# EAGLE design hauptplatine (EAGLE 9.6.2)
AUTHOR: Tobias Poppe; DOC_NR: 1; REV: 1.1

## Sheet 1 of 3
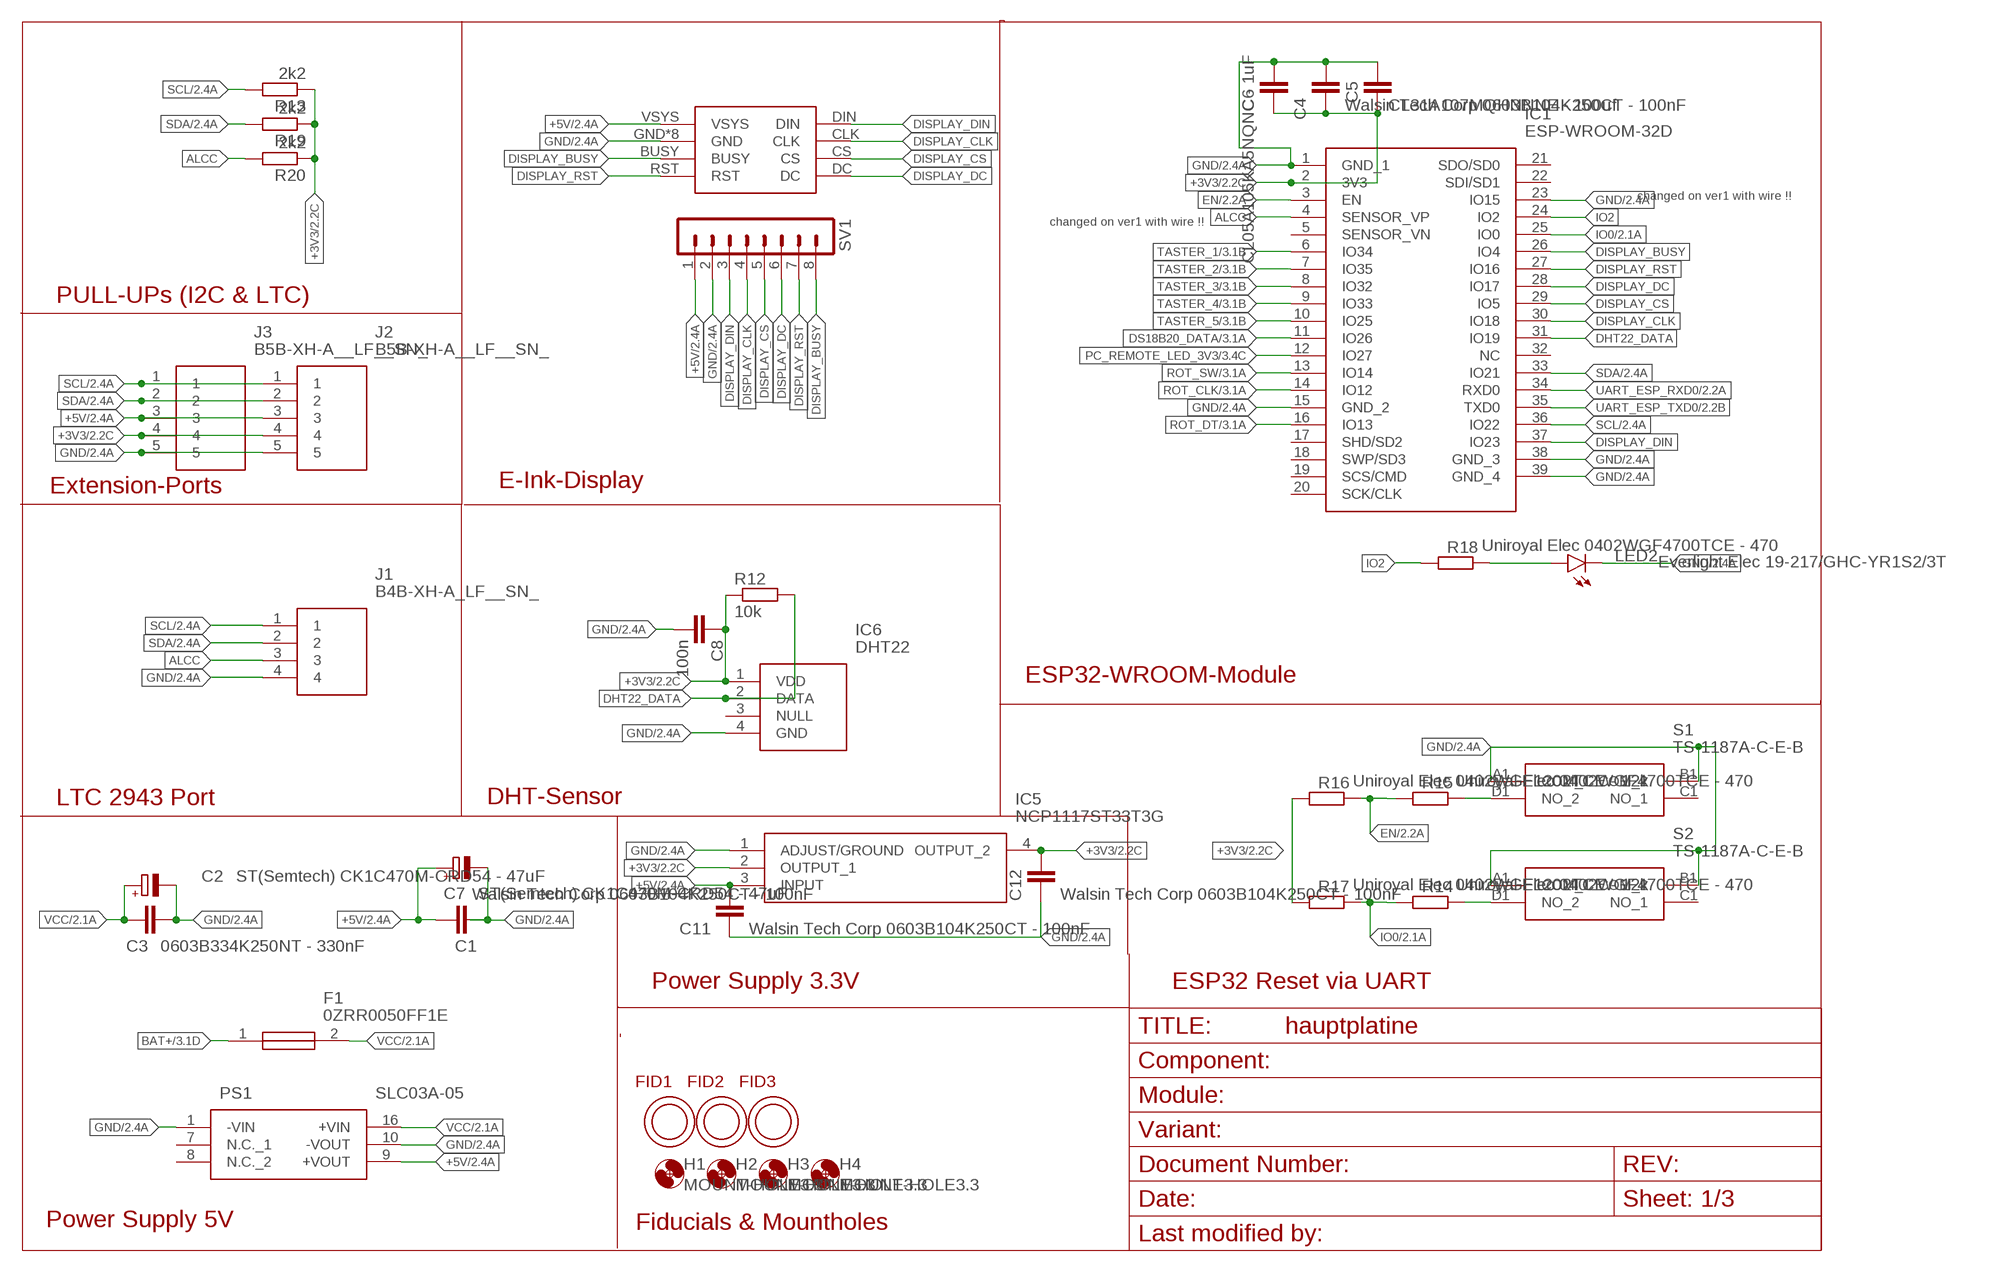
[diagram p0: schematic, sheet 1]

### Parts
C1  Walsin Tech Corp 0603B104K250CT - 100nF  C-EUC0603  [C0603]
C2  ST(Semtech) CK1C470M-CRD54 - 47uF  CPOL-EUC  [PANASONIC_C]
C3  0603B334K250NT - 330nF  C-EUC0603  [C0603]
C4  Walsin Tech Corp 0603B104K250CT - 100nF  C-EUC0603  [C0603]
C5  CL31A107MQHNNNE - 100uf  C-EUC1206  [C1206]
C6  CL05A105KA5NQNC - 1uF  C-EUC0402  [C0402]
C7  ST(Semtech) CK1C470M-CRD54 - 47uF  CPOL-EUC  [PANASONIC_C]
C8  100n  C-EUC1206  [C1206]
C11  Walsin Tech Corp 0603B104K250CT - 100nF  C-EUC0603  [C0603]
C12  Walsin Tech Corp 0603B104K250CT - 100nF  C-EUC0603  [C0603]
F1  0ZRR0050FF1E  [0ZRR0050FF1E]
FID1  OPEN-PNP-FIDUCIAL  [OPEN-PNP-FIDUCIAL]
FID2  OPEN-PNP-FIDUCIAL  [OPEN-PNP-FIDUCIAL]
FID3  OPEN-PNP-FIDUCIAL  [OPEN-PNP-FIDUCIAL]
H1  MOUNT-HOLE3.3  [3,3]
H2  MOUNT-HOLE3.3  [3,3]
H3  MOUNT-HOLE3.3  [3,3]
H4  MOUNT-HOLE3.3  [3,3]
IC1  ESP-WROOM-32D  [ESPWROOM32D]
IC5  NCP1117ST33T3G  [SOT230P700X180-4N]
IC6  DHT22  [DHT22]
J1  B4B-XH-A_LF__SN_  [B4BXHALFSN]
J2  B5B-XH-A__LF__SN_  [SHDR5W64P0X250_1X5_1490X575X70]
J3  B5B-XH-A__LF__SN_  [SHDR5W64P0X250_1X5_1490X575X70]
LED2  Everlight Elec 19-217/GHC-YR1S2/3T  LEDCHIPLED_0603  [CHIPLED_0603]
PS1  SLC03A-05  [SLC03A05]
R12  10k  R-EU_R1206  [R1206]
R13  2k2  R-EU_R1206  [R1206]
R14  Uniroyal Elec 0402WGF4700TCE - 470  R-EU_R0402  [R0402]
R15  Uniroyal Elec 0402WGF4700TCE - 470  R-EU_R0402  [R0402]
R16  Uniroyal Elec 0402WGF1202TCE - 12k  R-EU_R0402  [R0402]
R17  Uniroyal Elec 0402WGF1202TCE - 12k  R-EU_R0402  [R0402]
R18  Uniroyal Elec 0402WGF4700TCE - 470  R-EU_R0402  [R0402]
R19  2k2  R-EU_R1206  [R1206]
R20  2k2  R-EU_R1206  [R1206]
S1  TS-1187A-C-E-B  [TS1187ACEB]
S2  TS-1187A-C-E-B  [TS1187ACEB]
SV1  MA08-1  [MA08-1]
U$1  PICO-EPAPER-2.9-V3  [PICO-EPAPER-2.9-V3]

### Nets
+3V3: C4.1 C5.2 C6.1 C8.1 C12.2 IC1.2(3V3) IC5.2(OUTPUT_1) IC5.4(OUTPUT_2) IC6.1(VDD) J2.4 J3.4 R12.1 R13.1 R16.1 R17.1 R19.1 R20.1 ; also sheet 2,3
+5V: C1.1 C7.+ C11.2 IC5.3(INPUT) J2.3 J3.3 PS1.9(+VOUT) SV1.1 U$1.VSYS ; also sheet 2,3
ALCC: IC1.4(SENSOR_VP) J1.3 R20.2
BAT+: F1.1 ; also sheet 3
DHT22_DATA: IC1.31(IO19) IC6.2(DATA) R12.2
DISPLAY_BUSY: IC1.26(IO4) SV1.8 U$1.BUSY
DISPLAY_CLK: IC1.30(IO18) SV1.4 U$1.CLK
DISPLAY_CS: IC1.29(IO5) SV1.5 U$1.CS
DISPLAY_DC: IC1.28(IO17) SV1.6 U$1.DC
DISPLAY_DIN: IC1.37(IO23) SV1.3 U$1.DIN
DISPLAY_RST: IC1.27(IO16) SV1.7 U$1.RST
DS18B20_DATA: IC1.11(IO26) ; also sheet 3
EN: IC1.3(EN) R15.1 R16.2 ; also sheet 2
GND: C1.2 C2.- C3.1 C4.2 C5.1 C6.2 C7.- C8.2 C11.1 C12.1 IC1.1(GND_1) IC1.15(GND_2) IC1.23(IO15) IC1.38(GND_3) IC1.39(GND_4) IC5.1(ADJUST/GROUND) IC6.4(GND) J1.4 J2.5 J3.5 LED2.C PS1.1(-VIN) PS1.10(-VOUT) S1.A1(COM_1) S1.B1(COM_2) S2.A1(COM_1) S2.B1(COM_2) SV1.2 U$1.GND U$1.GND1(GND) U$1.GND2(GND) U$1.GND3(GND) U$1.GND4(GND) U$1.GND5(GND) U$1.GND6(GND) U$1.GND7(GND) ; also sheet 2,3
IO0: IC1.25(IO0) R14.1 R17.2 ; also sheet 2
IO2: IC1.24(IO2) R18.1
N$10: R15.2 S1.D1(NO_2)
N$11: R14.2 S2.D1(NO_2)
N$12: LED2.A R18.2
PC_REMOTE_LED_3V3: IC1.12(IO27) ; also sheet 3
ROT_CLK: IC1.14(IO12) ; also sheet 3
ROT_DT: IC1.16(IO13) ; also sheet 3
ROT_SW: IC1.13(IO14) ; also sheet 3
SCL: IC1.36(IO22) J1.1 J2.1 J3.1 R13.2 ; also sheet 2
SDA: IC1.33(IO21) J1.2 J2.2 J3.2 R19.2 ; also sheet 2
TASTER_1: IC1.6(IO34) ; also sheet 3
TASTER_2: IC1.7(IO35) ; also sheet 3
TASTER_3: IC1.8(IO32) ; also sheet 3
TASTER_4: IC1.9(IO33) ; also sheet 3
TASTER_5: IC1.10(IO25) ; also sheet 3
UART_ESP_RXD0: IC1.34(RXD0) ; also sheet 2
UART_ESP_TXD0: IC1.35(TXD0) ; also sheet 2
VCC: C2.+ C3.2 F1.2 PS1.16(+VIN) ; also sheet 2,3
Unconnected: IC1.5(SENSOR_VN) IC1.17(SHD/SD2) IC1.18(SWP/SD3) IC1.19(SCS/CMD) IC1.20(SCK/CLK) IC1.21(SDO/SD0) IC1.22(SDI/SD1) IC1.32(NC) IC6.3(NULL) PS1.7(N.C._1) PS1.8(N.C._2) S1.C1(NO_1) S2.C1(NO_1)

### Notes on the sheet
- changed on ver1 with wire !!
- changed on ver1 with wire !!
- PULL-UPs (I2C & LTC)
- Extension-Ports | E-Ink-Display
- ESP32-WROOM-Module
- LTC 2943 Port | DHT-Sensor
- Power Supply 3.3V | ESP32 Reset via UART
- Power Supply 5V | Fiducials & Mountholes

## Sheet 2 of 3
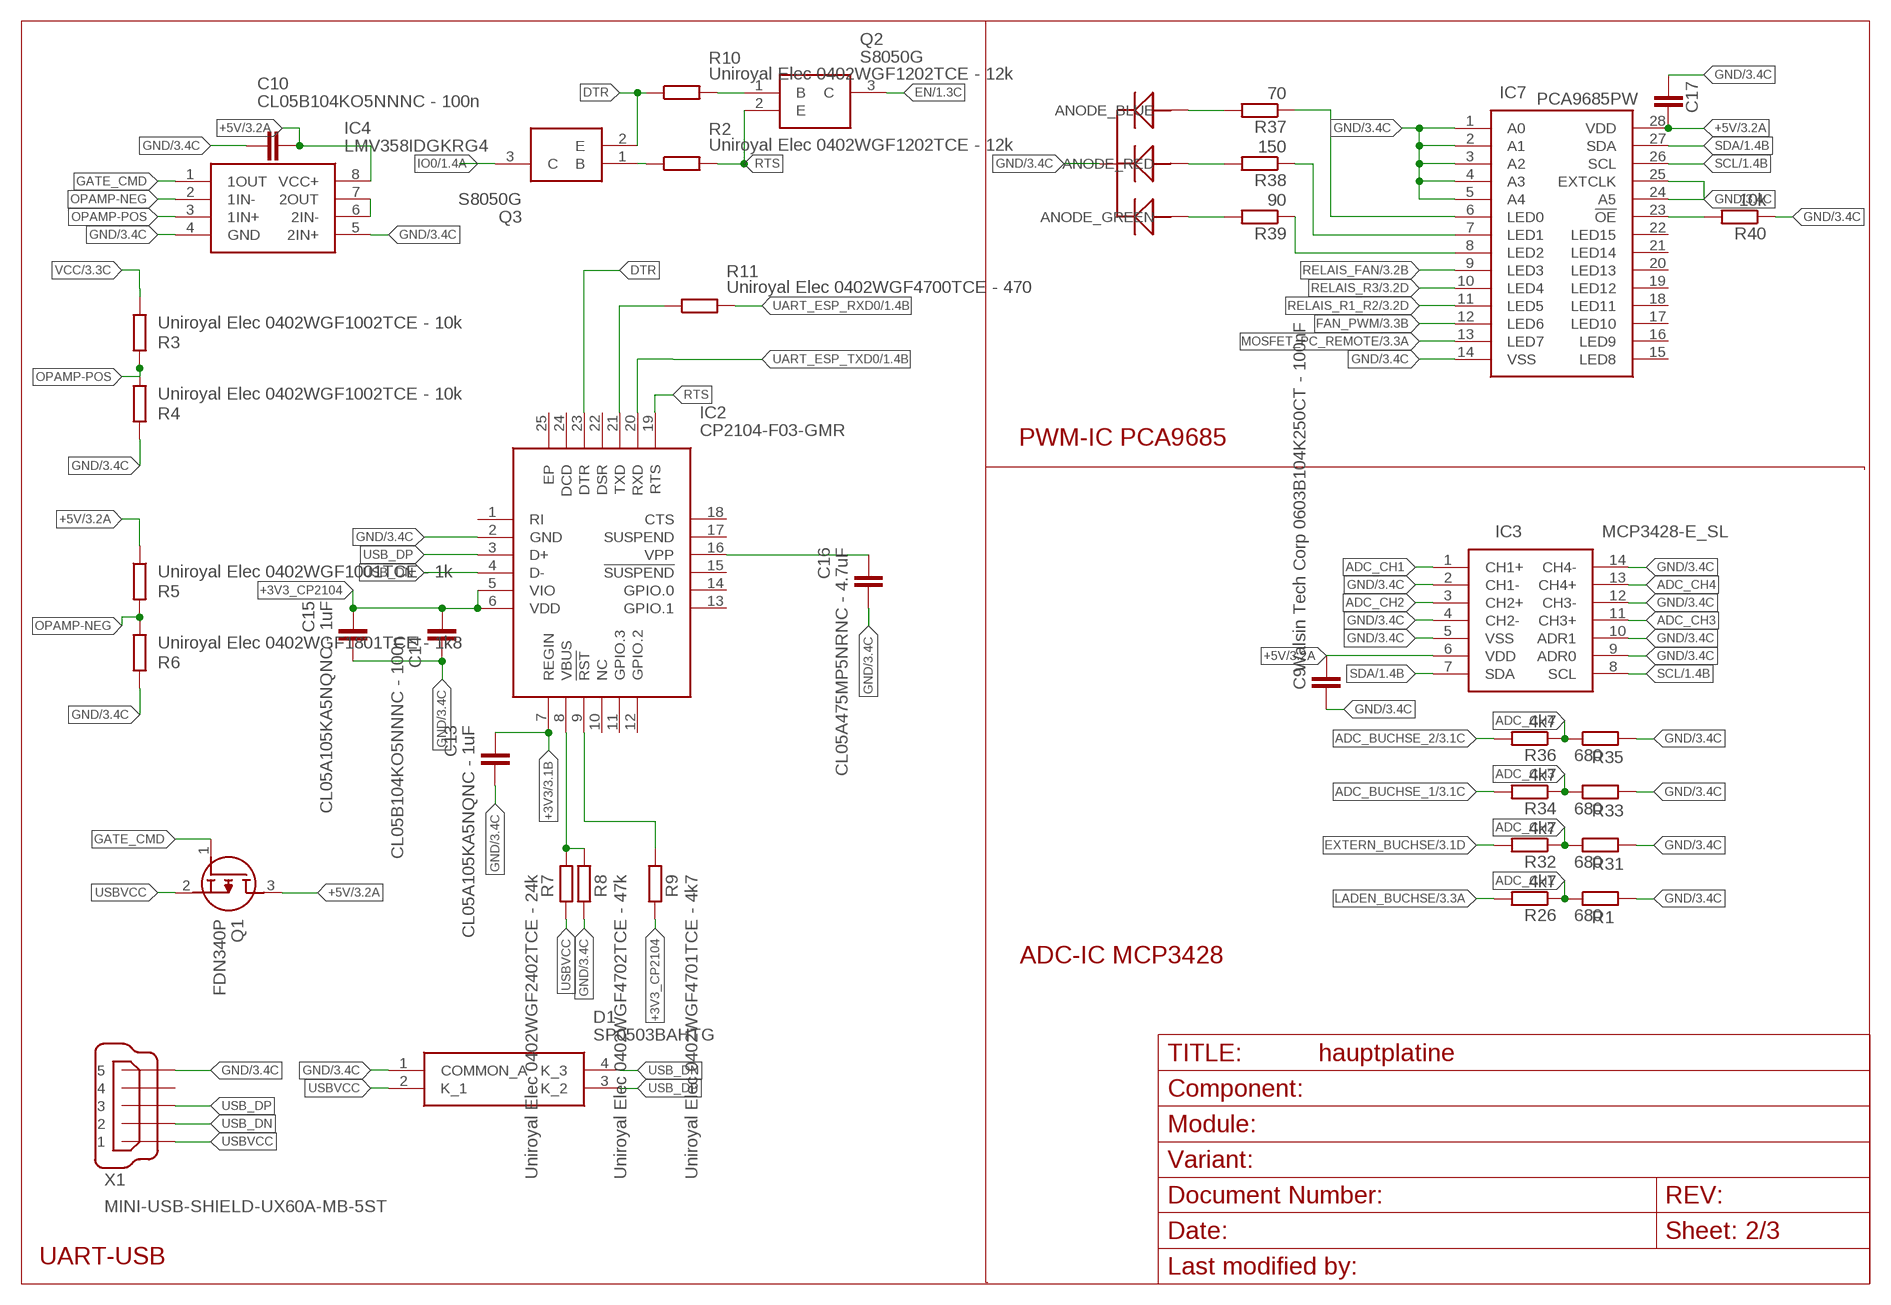
[diagram p1: schematic, sheet 2]

### Parts
C9  Walsin Tech Corp 0603B104K250CT - 100nF  C-EUC0603  [C0603]
C10  CL05B104KO5NNNC - 100n  C-EUC0402  [C0402]
C13  CL05A105KA5NQNC - 1uF  C-EUC0402  [C0402]
C14  CL05B104KO5NNNC - 100n  C-EUC0402  [C0402]
C15  CL05A105KA5NQNC - 1uF  C-EUC0402  [C0402]
C16  CL05A475MP5NRNC - 4.7uF  C-EUC0402  [C0402]
C17  Walsin Tech Corp 0603B104K250CT - 100nF  C-EUC0603  [C0603]
D1  SP0503BAHTG  [SP0503BAHTG]
IC2  CP2104-F03-GMR  [QFN50P400X400X80-25N]
IC3  MCP3428-E_SL  [SOIC127P600X175-14N]
IC4  LMV358IDGKRG4  [SOP65P490X110-8N]
IC7  PCA9685PW  [SOP65P640X110-28N]
Q1  FDN340P  [SOT95P237X112-3N]
Q2  S8050G  [SOT95P240X110-3N]
Q3  S8050G  [SOT95P240X110-3N]
R1  680  R-EU_R1206  [R1206]
R2  Uniroyal Elec 0402WGF1202TCE - 12k  R-EU_R0402  [R0402]
R3  Uniroyal Elec 0402WGF1002TCE - 10k  R-EU_R0402  [R0402]
R4  Uniroyal Elec 0402WGF1002TCE - 10k  R-EU_R0402  [R0402]
R5  Uniroyal Elec 0402WGF1001TCE - 1k  R-EU_R0402  [R0402]
R6  Uniroyal Elec 0402WGF1801TCE - 1k8  R-EU_R0402  [R0402]
R7  Uniroyal Elec 0402WGF2402TCE - 24k  R-EU_R0402  [R0402]
R8  Uniroyal Elec 0402WGF4702TCE - 47k  R-EU_R0402  [R0402]
R9  Uniroyal Elec 0402WGF4701TCE - 4k7  R-EU_R0402  [R0402]
R10  Uniroyal Elec 0402WGF1202TCE - 12k  R-EU_R0402  [R0402]
R11  Uniroyal Elec 0402WGF4700TCE - 470  R-EU_R0402  [R0402]
R26  4k7  R-EU_R1206  [R1206]
R31  680  R-EU_R1206  [R1206]
R32  4k7  R-EU_R1206  [R1206]
R33  680  R-EU_R1206  [R1206]
R34  4k7  R-EU_R1206  [R1206]
R35  680  R-EU_R1206  [R1206]
R36  4k7  R-EU_R1206  [R1206]
R37  70  R-EU_R1206  [R1206]
R38  150  R-EU_R1206  [R1206]
R39  90  R-EU_R1206  [R1206]
R40  10k  R-EU_R1206  [R1206]
U$12  RG_LED_5MM  [RGB_LED_5MM]
X1  MINI-USB-SHIELD-UX60A-MB-5ST  [UX60A-MB-5ST]

### Nets
+3V3: C13.2 IC2.7(REGIN) ; also sheet 1,3
+3V3_CP2104: C14.2 C15.2 IC2.5(VIO) IC2.6(VDD) R9.2
+5V: C9.2 C10.2 C17.1 IC3.6(VDD) IC4.8(VCC+) IC7.28(VDD) Q1.3(D) R5.1 ; also sheet 1,3
ADC_BUCHSE_1: R34.2 ; also sheet 3
ADC_BUCHSE_2: R36.2 ; also sheet 3
ADC_CH1: IC3.1(CH1+) R1.1 R26.1
ADC_CH2: IC3.3(CH2+) R31.1 R32.1
ADC_CH3: IC3.11(CH3+) R33.1 R34.1
ADC_CH4: IC3.13(CH4+) R35.1 R36.1
DTR: IC2.23(DTR) Q3.2(E) R10.1
EN: Q2.3(C) ; also sheet 1
EXTERN_BUCHSE: R32.2 ; also sheet 3
FAN_PWM: IC7.12(LED6) ; also sheet 3
GATE_CMD: IC4.1(1OUT) Q1.1(G)
GND: C9.1 C10.1 C13.1 C14.1 C15.1 C16.1 C17.2 D1.1(COMMON_A) IC2.2(GND) IC3.2(CH1-) IC3.4(CH2-) IC3.5(VSS) IC3.9(ADR0) IC3.10(ADR1) IC3.12(CH3-) IC3.14(CH4-) IC4.4(GND) IC4.5(2IN+) IC7.1(A0) IC7.2(A1) IC7.3(A2) IC7.4(A3) IC7.5(A4) IC7.14(VSS) IC7.24(A5) IC7.25(EXTCLK) R1.2 R4.2 R6.2 R8.2 R31.2 R33.2 R35.2 R40.1 U$12.CATHODE X1.5 ; also sheet 1,3
IO0: Q3.3(C) ; also sheet 1
LADEN_BUCHSE: R26.2 ; also sheet 3
MOSFET_PC_REMOTE: IC7.13(LED7) ; also sheet 3
N$3: Q3.1(B) R2.1
N$4: IC4.6(2IN-) IC4.7(2OUT)
N$5: IC2.8(VBUS) R7.1 R8.1
N$6: IC2.9(!RST) R9.1
N$7: C16.2 IC2.16(VPP)
N$8: IC2.21(TXD) R11.1
N$9: Q2.1(B) R10.2
N$16: R39.2 U$12.ANODE_GREEN
N$20: R37.2 U$12.ANODE_BLUE
N$22: R38.2 U$12.ANODE_RED
N$23: IC7.23(!OE) R40.2
OPAMP-NEG: IC4.2(1IN-) R5.2 R6.1
OPAMP-POS: IC4.3(1IN+) R3.2 R4.1
RELAIS_FAN: IC7.9(LED3) ; also sheet 3
RELAIS_R1_R2: IC7.11(LED5) ; also sheet 3
RELAIS_R3: IC7.10(LED4) ; also sheet 3
RGB_BLAU1: IC7.6(LED0) R37.1
RGB_GREEN1: IC7.8(LED2) R39.1
RGB_ROT1: IC7.7(LED1) R38.1
RTS: IC2.19(RTS) Q2.2(E) R2.2
SCL: IC3.8(SCL) IC7.26(SCL) ; also sheet 1
SDA: IC3.7(SDA) IC7.27(SDA) ; also sheet 1
UART_ESP_RXD0: R11.2 ; also sheet 1
UART_ESP_TXD0: IC2.20(RXD) ; also sheet 1
USB_DN: D1.4(K_3) IC2.4(D-) X1.2
USB_DP: D1.3(K_2) IC2.3(D+) X1.3
USBVCC: D1.2(K_1) Q1.2(S) R7.2 X1.1
VCC: R3.1 ; also sheet 1,3
Unconnected: IC2.1(RI) IC2.10(NC) IC2.11(GPIO.3) IC2.12(GPIO.2) IC2.13(GPIO.1) IC2.14(GPIO.0) IC2.15(!SUSPEND) IC2.17(SUSPEND) IC2.18(CTS) IC2.22(DSR) IC2.24(DCD) IC2.25(EP) IC7.15(LED8) IC7.16(LED9) IC7.17(LED10) IC7.18(LED11) IC7.19(LED12) IC7.20(LED13) IC7.21(LED14) IC7.22(LED15) X1.4 X1.M1(S1) X1.M2(S2) X1.M3(S3) X1.M4(S4)

### Notes on the sheet
- PWM-IC PCA9685
- ADC-IC MCP3428
- UART-USB

## Sheet 3 of 3
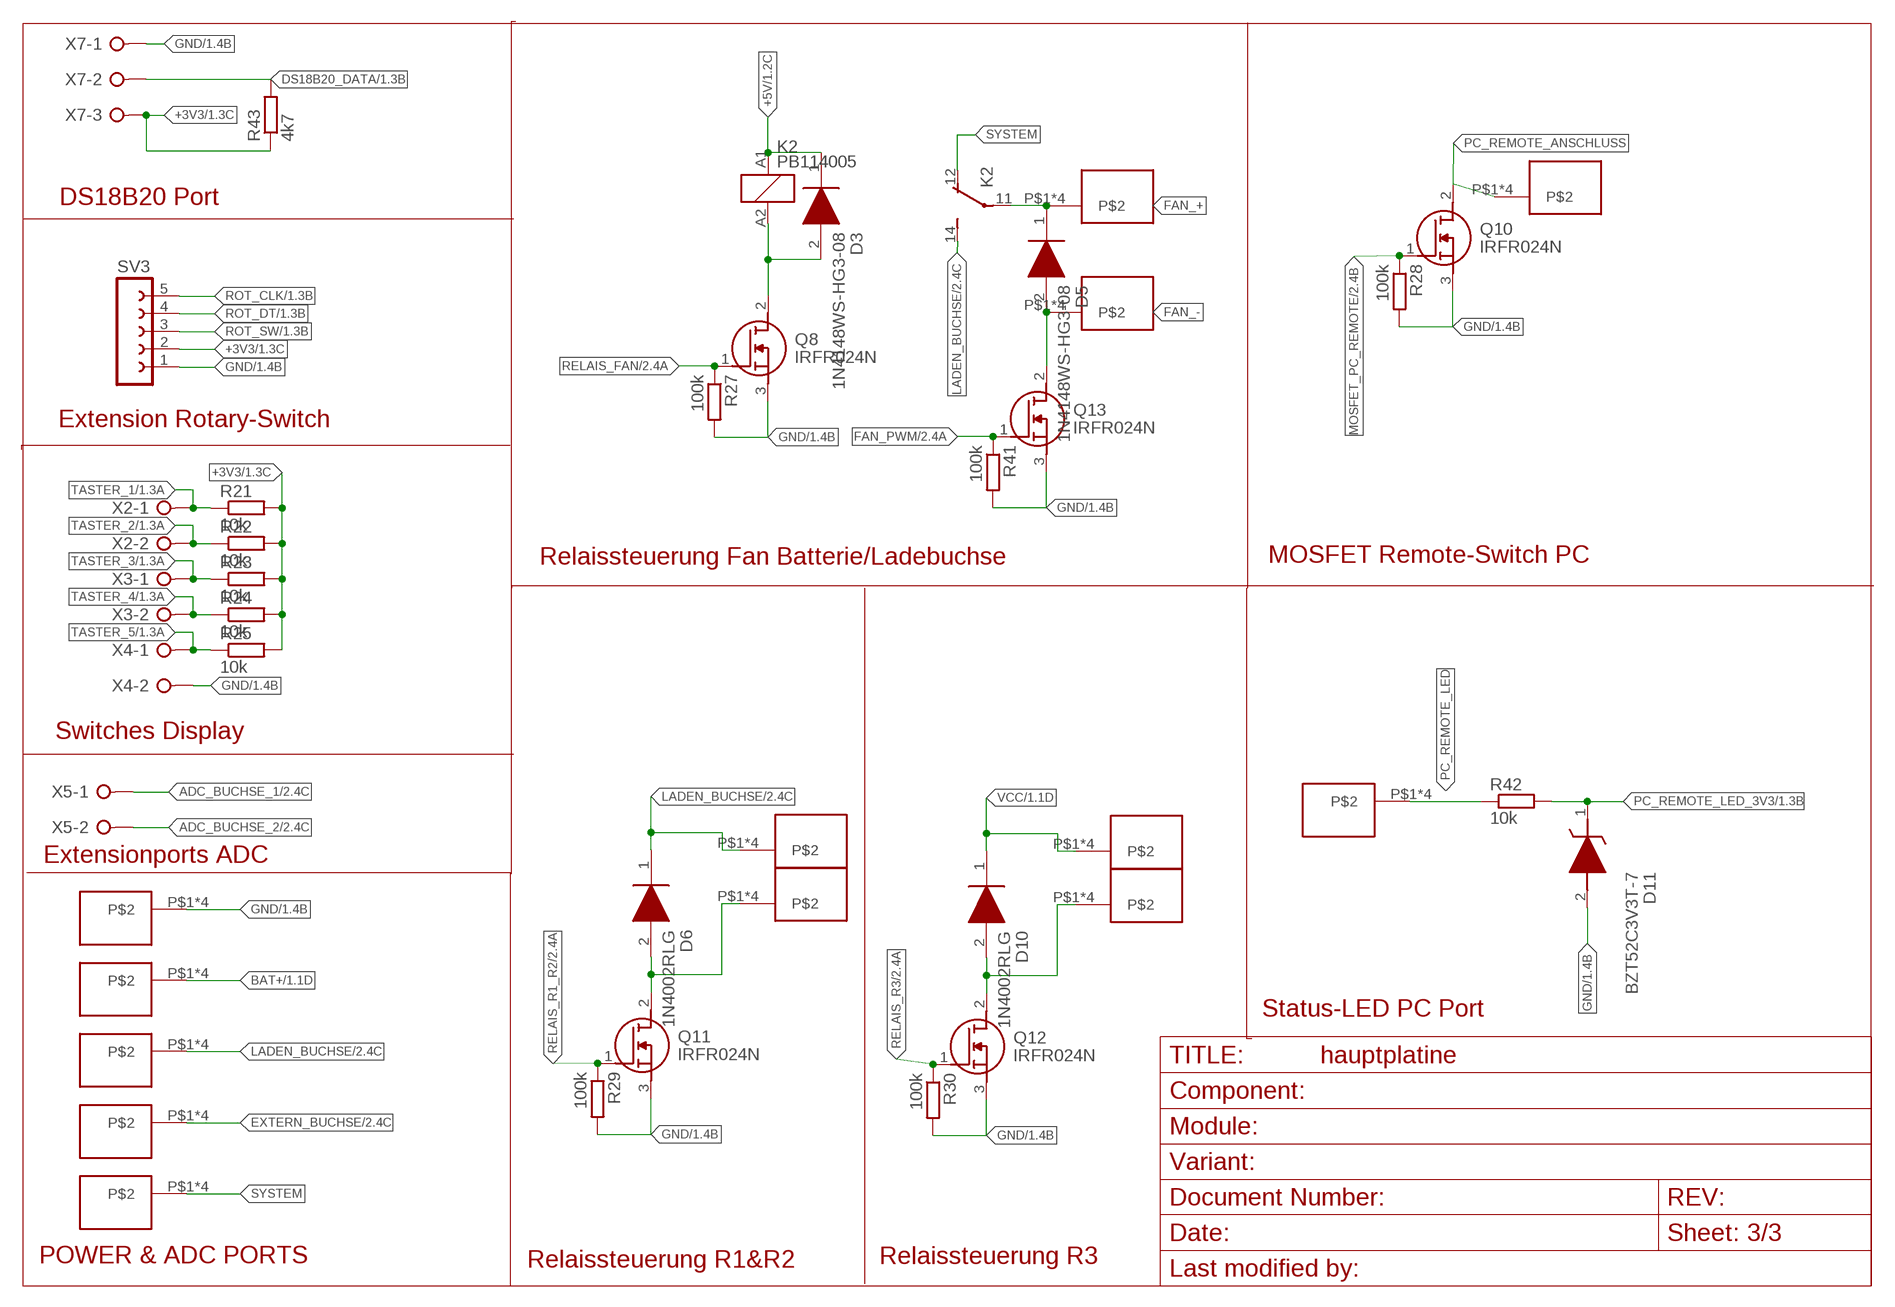
[diagram p2: schematic, sheet 3]

### Parts
D3  1N4148WS-HG3-08  [SOD2713X115N]
D5  1N4148WS-HG3-08  [SOD2713X115N]
D6  1N4002RLG  [DIOAD1405W86L465D235]
D10  1N4002RLG  [DIOAD1405W86L465D235]
D11  BZT52C3V3T-7  [SODFL1608X65N]
K2  PB114005  PB114006  [PB]
Q8  IRFR024N  IRFR024TRPBF-BE3  [IRFR024TRPBFBE3]
Q10  IRFR024N  IRFR024TRPBF-BE3  [IRFR024TRPBFBE3]
Q11  IRFR024N  IRFR024TRPBF-BE3  [IRFR024TRPBFBE3]
Q12  IRFR024N  IRFR024TRPBF-BE3  [IRFR024TRPBFBE3]
Q13  IRFR024N  IRFR024TRPBF-BE3  [IRFR024TRPBFBE3]
R21  10k  R-EU_R0805  [R0805]
R22  10k  R-EU_R0805  [R0805]
R23  10k  R-EU_R0805  [R0805]
R24  10k  R-EU_R0805  [R0805]
R25  10k  R-EU_R0805  [R0805]
R27  100k  R-EU_R1206  [R1206]
R28  100k  R-EU_R1206  [R1206]
R29  100k  R-EU_R1206  [R1206]
R30  100k  R-EU_R1206  [R1206]
R41  100k  R-EU_R1206  [R1206]
R42  10k  R-EU_R1206  [R1206]
R43  4k7  R-EU_R0805  [R0805]
SV3  FE05-1  [FE05-1]
U$2  WE-REDCUBE-74650173  [WE-REDCUBE-74650173]
U$17  WE-REDCUBE-74650173  [WE-REDCUBE-74650173]
U$18  WE-REDCUBE-74650173  [WE-REDCUBE-74650173]
U$19  WE-REDCUBE-74650173  [WE-REDCUBE-74650173]
U$20  WE-REDCUBE-74650173  [WE-REDCUBE-74650173]
U$21  WE-REDCUBE-74650173  [WE-REDCUBE-74650173]
U$22  WE-REDCUBE-74650173  [WE-REDCUBE-74650173]
U$23  WE-REDCUBE-74650173  [WE-REDCUBE-74650173]
U$24  WE-REDCUBE-74650173  [WE-REDCUBE-74650173]
U$25  WE-REDCUBE-74650173  [WE-REDCUBE-74650173]
U$26  WE-REDCUBE-74650173  [WE-REDCUBE-74650173]
U$27  WE-REDCUBE-74650173  [WE-REDCUBE-74650173]
U$28  WE-REDCUBE-74650173  [WE-REDCUBE-74650173]
X2  W237-02P  [W237-132]
X3  W237-02P  [W237-132]
X4  W237-02P  [W237-132]
X5  W237-02P  [W237-132]
X7  W237-3E  [W237-3E]

### Nets
+3V3: R21.2 R22.2 R23.2 R24.2 R25.2 R43.1 SV3.2 X7.3 ; also sheet 1,2
+5V: D3.1(K) K2.A1 ; also sheet 1,2
ADC_BUCHSE_1: X5.1 ; also sheet 2
ADC_BUCHSE_2: X5.2 ; also sheet 2
BAT+: U$17.P$1 U$17.P$2 U$17.P$3 U$17.P$4 ; also sheet 1
DS18B20_DATA: R43.2 X7.2 ; also sheet 1
EXTERN_BUCHSE: U$19.P$1 U$19.P$2 U$19.P$3 U$19.P$4 ; also sheet 2
FAN_+: D5.1(K) K2.11(2:P) U$24.P$1 U$24.P$2 U$24.P$3 U$24.P$4
FAN_-: D5.2(A) Q13.2(D) U$27.P$1 U$27.P$2 U$27.P$3 U$27.P$4
FAN_PWM: Q13.1(G) R41.1 ; also sheet 2
GND: D11.2(A) Q8.3(S) Q10.3(S) Q11.3(S) Q12.3(S) Q13.3(S) R27.2 R28.2 R29.2 R30.2 R41.2 SV3.1 U$2.P$1 U$2.P$2 U$2.P$3 U$2.P$4 X4.2 X7.1 ; also sheet 1,2
LADEN_BUCHSE: D6.1(K) K2.14(2:S) U$18.P$1 U$18.P$2 U$18.P$3 U$18.P$4 U$21.P$1 U$21.P$2 U$21.P$3 U$21.P$4 ; also sheet 2
MOSFET_PC_REMOTE: Q10.1(G) R28.1 ; also sheet 2
N$13: D3.2(A) K2.A2 Q8.2(D)
PC_REMOTE_ANSCHLUSS: Q10.2(D) U$25.P$1 U$25.P$2 U$25.P$3 U$25.P$4
PC_REMOTE_LED: R42.1 U$28.P$1 U$28.P$2 U$28.P$3 U$28.P$4
PC_REMOTE_LED_3V3: D11.1(K) R42.2 ; also sheet 1
RELAIS_FAN: Q8.1(G) R27.1 ; also sheet 2
RELAIS_R1_R2: Q11.1(G) R29.1 ; also sheet 2
RELAIS_R1_R2_ANSCHLUSS: D6.2(A) Q11.2(D) U$20.P$1 U$20.P$2 U$20.P$3 U$20.P$4
RELAIS_R3: Q12.1(G) R30.1 ; also sheet 2
RELAIS_R3_ANSCHLUSS: D10.2(A) Q12.2(D) U$22.P$1 U$22.P$2 U$22.P$3 U$22.P$4
ROT_CLK: SV3.5 ; also sheet 1
ROT_DT: SV3.4 ; also sheet 1
ROT_SW: SV3.3 ; also sheet 1
SYSTEM: K2.12(2:O) U$26.P$1 U$26.P$2 U$26.P$3 U$26.P$4
TASTER_1: R21.1 X2.1 ; also sheet 1
TASTER_2: R22.1 X2.2 ; also sheet 1
TASTER_3: R23.1 X3.1 ; also sheet 1
TASTER_4: R24.1 X3.2 ; also sheet 1
TASTER_5: R25.1 X4.1 ; also sheet 1
VCC: D10.1(K) U$23.P$1 U$23.P$2 U$23.P$3 U$23.P$4 ; also sheet 1,2

### Notes on the sheet
- DS18B20 Port
- Extension Rotary-Switch
- Relaissteuerung Fan Batterie/Ladebuchse | MOSFET Remote-Switch PC
- Switches Display
- Extensionports ADC
- Status-LED PC Port
- POWER & ADC PORTS | Relaissteuerung R1&R2 | Relaissteuerung R3

## Library data of the parts
C1 C3-C6 C9-C17 = rcl:C-EU: CAPACITOR, European symbol; SPICEPREFIX: C
C2 C7 = rcl:CPOL-EU: POLARIZED CAPACITOR, European symbol; SPICEPREFIX: C
C8 = rcl:C-EU: CAPACITOR, European symbol
D1 = samacsys:SP0503BAHTG: ESD Suppressors / TVS Diodes TVS AVAL DIODE SMT Source: Datasheet <https://nl.mouser.com/datasheet/2/240/Littelfuse_TVS_Diode_Array_SP05_Datasheet.pdf-777043.pdf>; ARROW_PART_NUMBER: SP0503BAHTG; ARROW_PRICE-STOCK: https://www.arrow.com/en/products/sp0503bahtg/littelfuse; DESCRIPTION: ESD Suppressors / TVS Diodes TVS AVAL DIODE SMT; HEIGHT: 1.22mm; MANUFACTURER_NAME: LITTELFUSE; MANUFACTURER_PART_NUMBER: SP0503BAHTG; MOUSER_PART_NUMBER: 576-SP0503BAHTG; MOUSER_PRICE-STOCK: https://www.mouser.co.uk/ProductDetail/Littelfuse/SP0503BAHTG?qs=uD%2FdkN7XIa0NTYXwHdELYA%3D%3D
D3 D5 = samacsys:1N4148WS-HG3-08: Diodes - General Purpose, Power, Switching 1V Vf, 4pF; 25nA Ir SOD-323 Source: Datasheet <https://mouser.componentsearchengine.com/Datasheets/1/1N4148WS-HG3-08.pdf>; ARROW_PART_NUMBER: 1N4148WS-HG3-08; ARROW_PRICE-STOCK: https://www.arrow.com/en/products/1n4148ws-hg3-08/vishay; DESCRIPTION: Diodes - General Purpose, Power, Switching 1V Vf, 4pF; 25nA Ir SOD-323; HEIGHT: 1.15mm; MANUFACTURER_NAME: Vishay; MANUFACTURER_PART_NUMBER: 1N4148WS-HG3-08; MOUSER_PART_NUMBER: 78-1N4148WS-HG3-08; MOUSER_PRICE-STOCK: https://www.mouser.co.uk/ProductDetail/Vishay-Semiconductors/1N4148WS-HG3-08?qs=MLItCLRbWsz%2FnO5zs5RZvA%3D%3D
D6 D10 = samacsys:1N4002RLG: Source: Datasheet <http://www.onsemi.com/pub/Collateral/1N4001-D.PDF>; ARROW_PART_NUMBER: 1N4002RLG; ARROW_PRICE-STOCK: https://www.arrow.com/en/products/1n4002rlg/on-semiconductor; HEIGHT: mm; MANUFACTURER_NAME: ON Semiconductor; MANUFACTURER_PART_NUMBER: 1N4002RLG; MOUSER_PART_NUMBER: 863-1N4002RLG; MOUSER_PRICE-STOCK: https://www.mouser.co.uk/ProductDetail/ON-Semiconductor/1N4002RLG/?qs=y2kkmE52mdMfmlxIpNIwcg%3D%3D
D11 = samacsys:BZT52C3V3T-7: Diodes Inc BZT52C3V3T-7 Zener Diode, 3.3V 6% 300 mW SMT 2-Pin SOD-523 Source: Datasheet <http://docs-emea.rs-online.com/webdocs/1325/0900766b81325340.pdf>; ARROW_PART_NUMBER: BZT52C3V3T-7; ARROW_PRICE-STOCK: https://www.arrow.com/en/products/bzt52c3v3t-7/diodes-incorporated; DESCRIPTION: Diodes Inc BZT52C3V3T-7 Zener Diode, 3.3V 6% 300 mW SMT 2-Pin SOD-523; HEIGHT: 0.65mm; MANUFACTURER_NAME: Diodes Inc.; MANUFACTURER_PART_NUMBER: BZT52C3V3T-7; MOUSER_PART_NUMBER: 621-BZT52C3V3T-7; MOUSER_PRICE-STOCK: https://www.mouser.co.uk/ProductDetail/Diodes-Incorporated/BZT52C3V3T-7?qs=zLeapIUCO8SeTE43ANZQdw%3D%3D
F1 = samacsys:0ZRR0050FF1E: Resettable Fuses - PPTC Resettable Fuse 500mA Source: Datasheet <https://www.mouser.in/datasheet/2/643/bel_06192018_0ZRR_Feb2018-1500412.pdf>; DESCRIPTION: Resettable Fuses - PPTC Resettable Fuse 500mA; HEIGHT: 13.7mm; MANUFACTURER_NAME: Bel; MANUFACTURER_PART_NUMBER: 0ZRR0050FF1E; MOUSER_PART_NUMBER: 530-0ZRR0050FF1E
FID1-FID3 = topo-eng:OPEN-PNP-FIDUCIAL
H1-H4 = holes:MOUNT-HOLE: MOUNTING HOLE with drill center marker
IC1 = samacsys:ESP-WROOM-32D: WiFi Modules (802.11) ESP32-D0WD 32 Mbits, 3.3 V 40 MHz onboard antenna (18.00+/-0.10) x (25.50+/-0.10) x (3.10+/-0.10) Source: Datasheet <https://componentsearchengine.com/Datasheets/1/ESP-WROOM-32D.pdf>; DESCRIPTION: WiFi Modules (802.11) ESP32-D0WD 32 Mbits, 3.3 V 40 MHz onboard antenna (18.00+/-0.10) x (25.50+/-0.10) x (3.10+/-0.10); HEIGHT: 3.2mm; MANUFACTURER_NAME: Espressif Systems; MANUFACTURER_PART_NUMBER: ESP-WROOM-32D; MOUSER_PART_NUMBER: 356-ESP-WROOM-32D; MOUSER_PRICE-STOCK: https://www.mouser.com/Search/Refine.aspx?Keyword=356-ESP-WROOM-32D
IC2 = samacsys:CP2104-F03-GMR: USB-to-UART 1-CH 576byte FIFO 3.3V Automotive 24-Pin QFN EP T/R Source: Datasheet <https://www.silabs.com/documents/public/data-sheets/cp2104.pdf>; ARROW_PART_NUMBER: CP2104-F03-GMR; ARROW_PRICE-STOCK: https://www.arrow.com/en/products/cp2104-f03-gmr/silicon-labs; DESCRIPTION: USB-to-UART 1-CH 576byte FIFO 3.3V Automotive 24-Pin QFN EP T/R; HEIGHT: 0.8mm; MANUFACTURER_NAME: Silicon Labs; MANUFACTURER_PART_NUMBER: CP2104-F03-GMR; MOUSER_PART_NUMBER: 634-CP2104-F03-GMR; MOUSER_PRICE-STOCK: https://www.mouser.co.uk/ProductDetail/Silicon-Labs/CP2104-F03-GMR?qs=1CB38rTTsYrRJKVkczeRzA%3D%3D
IC3 = samacsys:MCP3428-E_SL: 16-bit delta-sigma ADC, quad channel Source: Datasheet <http://docs-emea.rs-online.com/webdocs/0e24/0900766b80e24e90.pdf>; ARROW_PART_NUMBER: MCP3428-E/SL; ARROW_PRICE-STOCK: https://www.arrow.com/en/products/mcp3428-esl/microchip-technology?region=nac; DESCRIPTION: 16-bit delta-sigma ADC, quad channel; HEIGHT: 1.75mm; MANUFACTURER_NAME: Microchip; MANUFACTURER_PART_NUMBER: MCP3428-E/SL; MOUSER_PART_NUMBER: 579-MCP3428E/SL; MOUSER_PRICE-STOCK: https://www.mouser.co.uk/ProductDetail/Microchip-Technology/MCP3428-E-SL?qs=icxrp76fIjD%2FAq4p7ExZpg%3D%3D
IC4 = samacsys:LMV358IDGKRG4: Operational Amplifiers - Op Amps Dual Low-Voltage Rail-to-Rail Out Source: Datasheet <http://www.ti.com/lit/ds/symlink/lmv358.pdf>; ARROW_PART_NUMBER: LMV358IDGKRG4; ARROW_PRICE-STOCK: https://www.arrow.com/en/products/lmv358idgkrg4/texas-instruments; DESCRIPTION: Operational Amplifiers - Op Amps Dual Low-Voltage Rail-to-Rail Out; HEIGHT: 1.1mm; MANUFACTURER_NAME: Texas Instruments; MANUFACTURER_PART_NUMBER: LMV358IDGKRG4; MOUSER_PART_NUMBER: 595-LMV358IDGKRG4; MOUSER_PRICE-STOCK: https://www.mouser.co.uk/ProductDetail/Texas-Instruments/LMV358IDGKRG4?qs=paYhMW8qfiuzqo4cLPZoVQ%3D%3D
IC5 = samacsys:NCP1117ST33T3G: ON SEMICONDUCTOR - NCP1117ST33T3G - IC, LINEAR VOLTAGE REGULATOR Source: Datasheet <http://www.onsemi.com/pub/Collateral/NCP1117-D.PDF>; ARROW_PART_NUMBER: NCP1117ST33T3G; ARROW_PRICE-STOCK: https://www.arrow.com/en/products/ncp1117st33t3g/on-semiconductor; DESCRIPTION: ON SEMICONDUCTOR - NCP1117ST33T3G - IC, LINEAR VOLTAGE REGULATOR; HEIGHT: 1.8mm; MANUFACTURER_NAME: ON Semiconductor; MANUFACTURER_PART_NUMBER: NCP1117ST33T3G; MOUSER_PART_NUMBER: 863-NCP1117ST33T3G; MOUSER_PRICE-STOCK: https://www.mouser.co.uk/ProductDetail/ON-Semiconductor/NCP1117ST33T3G?qs=Gev%252BmEvV0iZb%2FE8ahUDx3w%3D%3D
IC6 = samacsys:DHT22: Digital-output relative humidity & temperature sensor/module DHT22 Source: Datasheet <https://datasheet4u.com/datasheet-parts/DHT22-datasheet.php?id=792211>; DESCRIPTION: Digital-output relative humidity & temperature sensor/module DHT22; HEIGHT: 25.1mm; MANUFACTURER_NAME: Aosong Electronics; MANUFACTURER_PART_NUMBER: DHT22
IC7 = samacsys:PCA9685PW: LED DRIVER, RGBA, 28-TSSOP Source: Datasheet <http://docs-asia.electrocomponents.com/webdocs/0f65/0900766b80f65101.pdf>; DESCRIPTION: LED DRIVER, RGBA, 28-TSSOP; HEIGHT: 1.1mm; MANUFACTURER_NAME: Nexperia; MANUFACTURER_PART_NUMBER: PCA9685PW; MOUSER_PART_NUMBER: N/A; MOUSER_PRICE-STOCK: https://www.mouser.com/Search/Refine.aspx?Keyword=N%2FA
J1 = samacsys:B4B-XH-A_LF__SN_: CONN HEADER VERT 4POS 2.5MM Source: Datasheet <https://datasheet.lcsc.com/szlcsc/JST-Sales-America-B4B-XH-A-LF-SN_C144395.pdf>; ARROW_PART_NUMBER: B4B-XH-A(LF)(SN); ARROW_PRICE-STOCK: https://www.arrow.com/en/products/b4b-xh-a-lf-sn/jst-manufacturing; DESCRIPTION: CONN HEADER VERT 4POS 2.5MM; HEIGHT: 7mm; MANUFACTURER_NAME: JST (JAPAN SOLDERLESS TERMINALS); MANUFACTURER_PART_NUMBER: B4B-XH-A(LF)(SN)
J2 J3 = samacsys:B5B-XH-A__LF__SN_: Shrouded hdr,XH,2.5mm pitch,straight,5w JST XH Series, 2.5mm Pitch 5 Way 1 Row Straight PCB Header, Solder Termination, 3A Source: Datasheet <http://www.farnell.com/datasheets/1684882.pdf>; DESCRIPTION: Shrouded hdr,XH,2.5mm pitch,straight,5w JST XH Series, 2.5mm Pitch 5 Way 1 Row Straight PCB Header, Solder Termination, 3A; HEIGHT: 7mm; MANUFACTURER_NAME: JST (JAPAN SOLDERLESS TERMINALS); MANUFACTURER_PART_NUMBER: B5B-XH-A (LF)(SN)
K2 = relay:PB?14*: Miniature Power PCB Relay SCHRACK 1pole 10 A Source: http://www.schrack.com/.. 5846.pdf; MF: TYCO ELECTRONICS; MPN: PB114006; OC_FARNELL: 1175076; OC_NEWARK: 85C1482
LED2 = led:LED: LED OSRAM: - CHIPLED LG R971, LG N971, LY N971, LG Q971, LY Q971, LO R971, LY R971 LH N974, LH R974 LS Q976, LO Q976, LY Q976 LO Q996 - Hyper CHIPLED LW Q18S LB Q993, LB Q99A, LB R99A - SideLED LS A670, LO A670, LY A670, LG A670, LP A670 LB A673, LV A673, LT A673, LW A673 LH A674 LY A675 LS A676, LA A676, LO A676, LY A676, LW A676 LS A679, LY A679, LG A679 - Hyper Micro SIDELED® LS Y876, LA Y876, LO Y876, LY Y876 LT Y87S - SmartLED LW L88C, LW L88S LB L89C, LB L89S, LG L890 LS L89K, LO L89K, LY L89K LS L896, LA L896, LO L896, LY L896 - TOPLED LS T670, LO T670, LY T670, LG T670, LP T670 LSG T670, LSP T670, LSY T670, LOP T670, LYG T670 LG T671, LOG T671, LSG T671 LB T673, LV T673, LT T673, LW T673 LH T674 LS T676, LA T676, LO T676, LY T676, LB T676, LH T676, LSB T676, LW T676 LB T67C, LV T67C, LT T67C, LS T67K, LO T67K, LY T67K, LW E67C LS E67B, LA E67B, LO E67B, LY E67B, LB E67C, LV E67C, LT E67C LW T67C LS T679, LY T679, LG T679 LS T770, LO T770, LY T770, LG T770, LP T770 LB T773, LV T773, LT T773, LW T773 LH T774 LS E675, LA E675, LY E675, LS T675 LS T776, LA T776, LO T776, LY T776, LB T776 LHGB T686 LT T68C, LB T68C - Hyper Mini TOPLED® LB M676 - Mini TOPLED Santana® LG M470 LS M47K, LO M47K, LY M47K Source: http://www.osram.convergy.de LUXEON: - LUMILED® LXK2-PW12-R00, LXK2-PW12-S00, LXK2-PW14-U00, LXK2-PW14-V00 LXK2-PM12-R00, LXK2-PM12-S00, LXK2-PM14-U00 LXK2-PE12-Q00, LXK2-PE12-R00, LXK2-PE12-S00, LXK2-PE14-T00, LXK2-PE14-U00 LXK2-PB12-K00, LXK2-PB12-L00, LXK2-PB12-M00, LXK2-PB14-N00, LXK2-PB14-P00, LXK2-PB14-Q00 LXK2-PR12-L00, LXK2-PR12-M00, LXK2-PR14-Q00, LXK2-PR14-R00 LXK2-PD12-Q00, LXK2-PD12-R00, LXK2-PD12-S00 LXK2-PH12-R00, LXK2-PH12-S00 LXK2-PL12-P00, LXK2-PL12-Q00, LXK2-PL12-R00 Source: www.luxeon.com KINGBRIGHT: KA-3528ASYC Source: www.kingbright.com
PS1 = samacsys:SLC03A-05: Isolated DC/DC Converters 9-18Vin 5Vout 600mA DIP16 Reg Iso Source: Datasheet <https://www.arrow.com/en/products/slc03a-05/mean-well-enterprises>; ARROW_PART_NUMBER: SLC03A-05; ARROW_PRICE-STOCK: https://www.arrow.com/en/products/slc03a-05/mean-well-enterprises?region=nac; DESCRIPTION: Isolated DC/DC Converters 9-18Vin 5Vout 600mA DIP16 Reg Iso; HEIGHT: 8.8mm; MANUFACTURER_NAME: Mean Well; MANUFACTURER_PART_NUMBER: SLC03A-05; MOUSER_PART_NUMBER: 709-SLC03A-05; MOUSER_PRICE-STOCK: https://www.mouser.co.uk/ProductDetail/MEAN-WELL/SLC03A-05?qs=5aG0NVq1C4zKZvVvmNhyyA%3D%3D
Q1 = samacsys:FDN340P: Trans MOSFET P-CH 20V 2A 3-Pin SuperSOT Source: Datasheet <https://www.onsemi.com/pub/Collateral/FDN340P-D.PDF>; ARROW_PART_NUMBER: FDN340P; ARROW_PRICE-STOCK: https://www.arrow.com/en/products/fdn340p/on-semiconductor; DESCRIPTION: Trans MOSFET P-CH 20V 2A 3-Pin SuperSOT; HEIGHT: 1.12mm; MANUFACTURER_NAME: ON Semiconductor; MANUFACTURER_PART_NUMBER: FDN340P; MOUSER_PART_NUMBER: 512-FDN340P; MOUSER_PRICE-STOCK: https://www.mouser.co.uk/ProductDetail/ON-Semiconductor-Fairchild/FDN340P?qs=AMp2PTjoga9dhzFXRaqTZw%3D%3D
Q2 Q3 = samacsys:S8050G: Silicon Epitaxial Planar Transistor Source: Datasheet <http://www.gmesemi.com/KUpload/product/TR/S8050 SOT-23.pdf>; DESCRIPTION: Silicon Epitaxial Planar Transistor; HEIGHT: 1.1mm; MANUFACTURER_NAME: Galaxy; MANUFACTURER_PART_NUMBER: S8050G
Q8 Q10-Q13 = samacsys:IRFR024TRPBF-BE3: MOSFET 60V N-CH HEXFET MOSFET D-PAK Source: Datasheet <https://www.mouser.com/datasheet/2/427/91264-1768572.pdf>; ARROW_PART_NUMBER: IRFR024TRPBF-BE3; ARROW_PRICE-STOCK: https://www.arrow.com/en/products/irfr024trpbf-be3/vishay?region=nac; DESCRIPTION: MOSFET 60V N-CH HEXFET MOSFET D-PAK; HEIGHT: 2.39mm; MANUFACTURER_NAME: Vishay; MANUFACTURER_PART_NUMBER: IRFR024TRPBF-BE3; MOUSER_PART_NUMBER: 78-IRFR024TRPBF-BE3; MOUSER_PRICE-STOCK: https://www.mouser.co.uk/ProductDetail/Vishay-Siliconix/IRFR024TRPBF-BE3?qs=zW32dvEIR3u8Wh7rBpn4Hw%3D%3D
R1 R12 R13 R19-R43 = rcl:R-EU_: RESISTOR, European symbol
R2-R11 R14-R18 = rcl:R-EU_: RESISTOR, European symbol; SPICEPREFIX: R
S1 S2 = samacsys:TS-1187A-C-E-B: SPST 50mA @ 12VDC 5.10mm x 5.10mm SMD Tactile Switches RoHS Source: Datasheet <https://datasheet.lcsc.com/szlcsc/XKB-TS-1187A-C-E-A_C318887.pdf>; DESCRIPTION: SPST 50mA @ 12VDC 5.10mm x 5.10mm SMD Tactile Switches RoHS; HEIGHT: 1.65mm; MANUFACTURER_NAME: XKB Enterprise; MANUFACTURER_PART_NUMBER: TS-1187A-C-E-B; MOUSER_PART_NUMBER: 611-PTS526SK15SMR2L
SV1 = con-lstb:MA08-1: PIN HEADER; OC_FARNELL: unknown; OC_NEWARK: unknown
SV3 = con-lsta:FE05-1: FEMALE HEADER; OC_FARNELL: unknown; OC_NEWARK: unknown
U$1 = topo-eng:PICO-EPAPER-2.9-V3
U$2 U$17-U$28 = topo-eng:WE-REDCUBE-74650173
U$12 = topo-eng:RG_LED_5MM
X1 = con-hirose:MINI-USB-SHIELD-: MINI USB Connector Source: http://www.hirose.co.jp/cataloge_hp/e24000019.pdf; OC_FARNELL: unknown; OC_NEWARK: unknown
X2-X5 = con-wago-508:W237-02P: WAGO SREW CLAMP; OC_FARNELL: unknown; OC_NEWARK: unknown
X7 = con-wago-508:W237-3E: WAGO SREW CLAMP; OC_FARNELL: unknown; OC_NEWARK: unknown

## Board
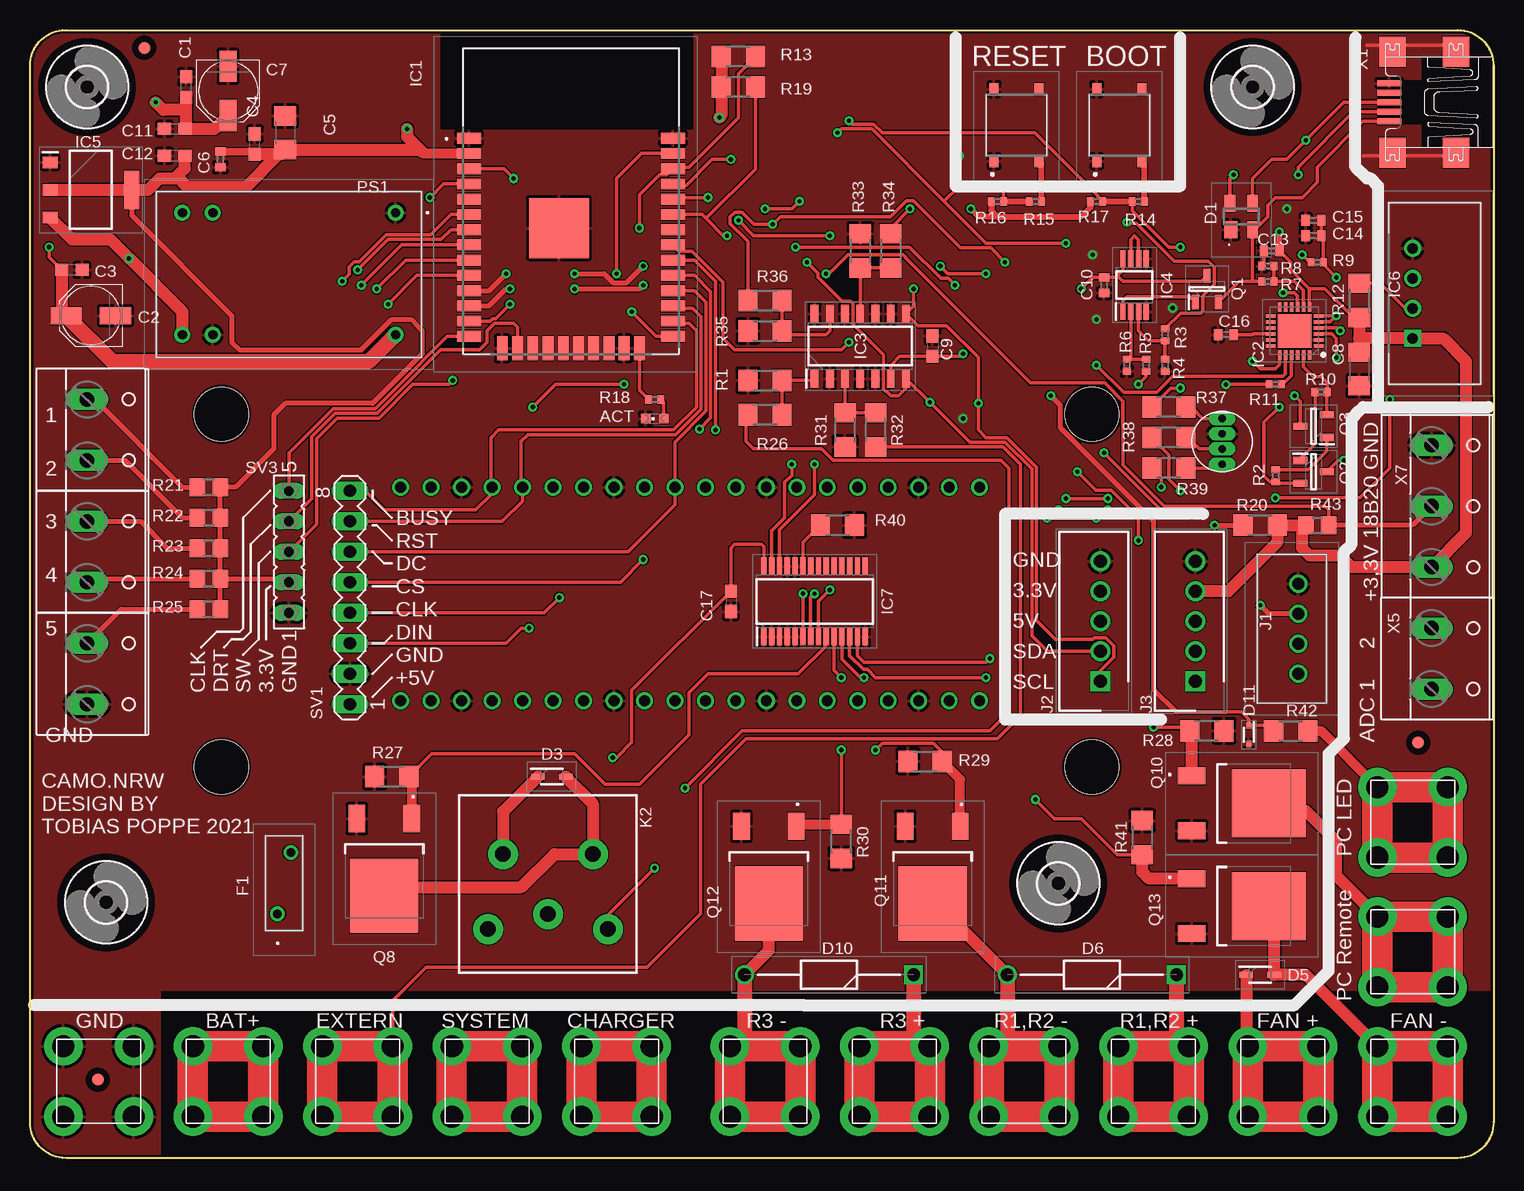
[diagram p3: board, top side]
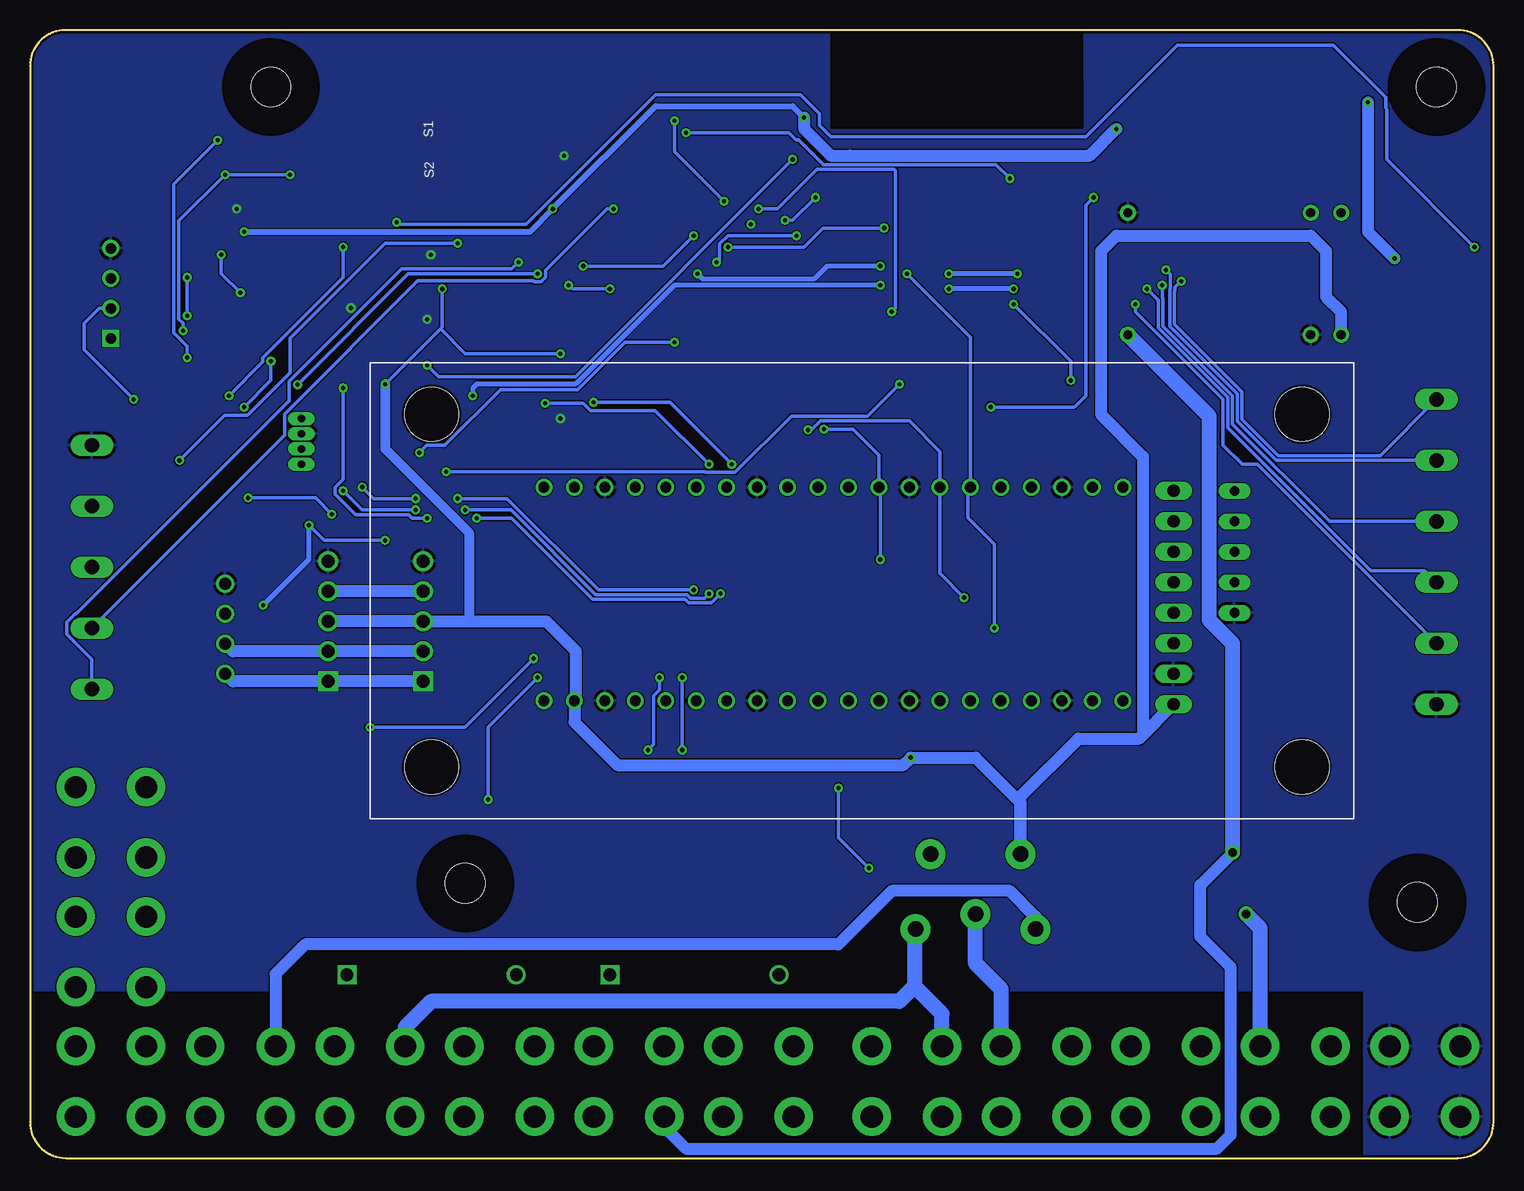
[diagram p4: board, bottom side, seen from below]

Size 122 x 94 mm. Coordinates in mm from the lower left corner, seen from the top.
Outline: 3,94 119,94 arc-90 122,91 122,3 arc-90 119,0 3,0 arc-90 0,3 0,91 arc-90 3,94
Copper layers (1*16): Top 0.035mm / dielectric 1.5mm / Bottom 0.035mm
Design rules "jlcpcb_4_layer *": minimum track width 3.5mil, minimum drill 0.2mm, track to track 3.5mil, track to pad 6mil, pad to pad 6mil, via to via 6mil, smd to smd 6mil, copper to edge 0.2mm, drill to drill 6mil, minimum pad ring 10mil, minimum via ring 8mil, stop-mask expansion 4mil, vias tented up to drill 0mil, thermal gap 10mil

### Footprints (pad centres in the part's own frame; a part is rotated, then mirrored left to right if it is on the bottom)
C0603 = smd 1.1 x 1: 1 -0.85,0; 2 0.85,0
PANASONIC_C = smd 2.6 x 1.4: + 2.05,0; - -2.05,0
C1206 = smd 1.6 x 1.8: 1 -1.4,0; 2 1.4,0
C0402 = smd 0.7 x 0.9: 1 -0.65,0; 2 0.65,0
SP0503BAHTG = smd 1.1 x 1.4: 1 -0.85,-1.1 | smd 0.9 x 1.4: 2 0.95,-1.1; 3 0.95,1.1; 4 -0.95,1.1
SOD2713X115N = smd 1.125 x 0.5: 1 -1.162,0; 2 1.162,0
DIOAD1405W86L465D235 = drill 1.05 pad 1.575 square: 1 0,0 | drill 1.05 pad 1.575: 2 14.1,0
SODFL1608X65N = smd 0.57 x 0.42: 1 -0.775,0; 2 0.775,0
0ZRR0050FF1E = drill 0.71 pad 1.217: 1 0,0; 2 5.1,-1.1
OPEN-PNP-FIDUCIAL = smd 1 x 1: FID$1 0,0
3,3 = hole 3.3: 0,0
ESPWROOM32D = smd 2 x 0.9: 1 -8.5,5.26; 2 -8.5,3.99; 3 -8.5,2.72; 4 -8.5,1.45; 5 -8.5,0.18; 6 -8.5,-1.09; 7 -8.5,-2.36; 8 -8.5,-3.63; 9 -8.5,-4.9; 10 -8.5,-6.17; 11 -8.5,-7.44; 12 -8.5,-8.71; 13 -8.5,-9.98; 14 -8.5,-11.25; 25 8.5,-11.25; 26 8.5,-9.98; 27 8.5,-8.71; 28 8.5,-7.44; 29 8.5,-6.17; 30 8.5,-4.9; 31 8.5,-3.63; 32 8.5,-2.36; 33 8.5,-1.09; 34 8.5,0.18; 35 8.5,1.45; 36 8.5,2.72; 37 8.5,3.99; 38 8.5,5.26 | smd 0.9 x 2: 15 -5.715,-12.25; 16 -4.445,-12.25; 17 -3.175,-12.25; 18 -1.905,-12.25; 19 -0.635,-12.25; 20 0.635,-12.25; 21 1.905,-12.25; 22 3.175,-12.25; 23 4.445,-12.25; 24 5.715,-12.25 | smd 5 x 5: 39 -1,-2.24
QFN50P400X400X80-25N = smd 0.8 x 0.3: 1 -2,1.25; 2 -2,0.75; 3 -2,0.25; 4 -2,-0.25; 5 -2,-0.75; 6 -2,-1.25; 13 2,-1.25; 14 2,-0.75; 15 2,-0.25; 16 2,0.25; 17 2,0.75; 18 2,1.25 | smd 0.3 x 0.8: 7 -1.25,-2; 8 -0.75,-2; 9 -0.25,-2; 10 0.25,-2; 11 0.75,-2; 12 1.25,-2; 19 1.25,2; 20 0.75,2; 21 0.25,2; 22 -0.25,2; 23 -0.75,2; 24 -1.25,2 | smd 2.8 x 2.8: 25 0,0
SOIC127P600X175-14N = smd 1.5 x 0.65: 1 -2.7,3.81; 2 -2.7,2.54; 3 -2.7,1.27; 4 -2.7,0; 5 -2.7,-1.27; 6 -2.7,-2.54; 7 -2.7,-3.81; 8 2.7,-3.81; 9 2.7,-2.54; 10 2.7,-1.27; 11 2.7,0; 12 2.7,1.27; 13 2.7,2.54; 14 2.7,3.81
SOP65P490X110-8N = smd 1.4 x 0.45: 1 -2.2,0.975; 2 -2.2,0.325; 3 -2.2,-0.325; 4 -2.2,-0.975; 5 2.2,-0.975; 6 2.2,-0.325; 7 2.2,0.325; 8 2.2,0.975
SOT230P700X180-4N = smd 1.25 x 0.95: 1 -3.4,2.3; 2 -3.4,0; 3 -3.4,-2.3 | smd 1.25 x 3.2: 4 3.4,0
DHT22 = drill 0.91 pad 1.416 square: 1 0,0 | drill 0.91 pad 1.416: 2 2.5,0; 3 5,0; 4 7.5,0
SOP65P640X110-28N = smd 1.475 x 0.45: 1 -2.938,4.225; 2 -2.938,3.575; 3 -2.938,2.925; 4 -2.938,2.275; 5 -2.938,1.625; 6 -2.938,0.975; 7 -2.938,0.325; 8 -2.938,-0.325; 9 -2.938,-0.975; 10 -2.938,-1.625; 11 -2.938,-2.275; 12 -2.938,-2.925; 13 -2.938,-3.575; 14 -2.938,-4.225; 15 2.938,-4.225; 16 2.938,-3.575; 17 2.938,-2.925; 18 2.938,-2.275; 19 2.938,-1.625; 20 2.938,-0.975; 21 2.938,-0.325; 22 2.938,0.325; 23 2.938,0.975; 24 2.938,1.625; 25 2.938,2.275; 26 2.938,2.925; 27 2.938,3.575; 28 2.938,4.225
B4BXHALFSN = drill 1 pad 1.5: 1 0,0; 2 2.5,0; 3 5,0; 4 7.5,0
SHDR5W64P0X250_1X5_1490X575X70 = drill 1.1 pad 1.65 square: 1 0,0 | drill 1.1 pad 1.65: 2 2.5,0; 3 5,0; 4 7.5,0; 5 10,0
PB = drill 1.3 pad 2.5: 11 3.81,-5; 12 2.56,0; 14 3.81,5; A1 -2.44,-3.75; A2 -2.44,3.75
CHIPLED_0603 = smd 0.8 x 0.8: A 0,-0.75; C 0,0.75
SLC03A05 = drill 0.78 pad 1.337: 1 0,0; 7 15.24,0; 8 17.78,0; 9 17.78,10.16; 10 15.24,10.16; 16 0,10.16
SOT95P237X112-3N = smd 1.2 x 0.6: 1 -1.1,0.95; 2 -1.1,-0.95; 3 1.1,0
SOT95P240X110-3N = smd 1.15 x 0.6: 1 -1.1,0.95; 2 -1.1,-0.95; 3 1.1,0
IRFR024TRPBFBE3 = smd 1.397 x 2.286: 1 -2.286,-4.12; 3 2.286,-4.12 | smd 5.69 x 6.18: 2 0,2.315
R1206 = smd 1.6 x 1.803: 1 -1.422,0; 2 1.422,0
R0402 = smd 0.6 x 0.7: 1 -0.5,0; 2 0.5,0
R0805 = smd 1.3 x 1.5: 1 -0.95,0; 2 0.95,0
TS1187ACEB = smd 1 x 0.75: A1 -3,1.875; B1 3,1.875; C1 3,-1.875; D1 -3,-1.875
MA08-1 = drill 1.016 long: 1 -8.89,0; 2 -6.35,0; 3 -3.81,0; 4 -1.27,0; 5 1.27,0; 6 3.81,0; 7 6.35,0; 8 8.89,0
FE05-1 = drill 0.813 long: 1 -5.08,0; 2 -2.54,0; 3 0,0; 4 2.54,0; 5 5.08,0
PICO-EPAPER-2.9-V3 = drill 0.9: BUSY 55.141,27.603; CLK 47.521,27.603; CS 42.441,27.603; DC 39.901,27.603; DIN 50.061,27.603; GND 57.681,27.603; GND1 19.581,27.603; GND2 32.281,27.603; GND3 44.981,27.603; GND4 57.681,9.823; GND5 44.981,9.823; GND6 32.281,9.823; GND7 19.581,9.823; P$1 14.501,27.603; P$2 17.041,27.603; P$4 22.121,27.603; P$5 24.661,27.603; P$6 27.201,27.603; P$7 29.741,27.603; P$9 34.821,27.603; P$10 37.361,27.603; P$19 60.221,27.603; P$20 62.761,27.603; P$21 14.501,9.823; P$30 22.121,9.823; P$31 24.661,9.823; P$32 27.201,9.823; P$33 29.741,9.823; P$35 34.821,9.823; P$36 37.361,9.823; P$37 39.901,9.823; P$38 42.441,9.823; P$40 47.521,9.823; P$41 50.061,9.823; P$42 52.601,9.823; P$43 55.141,9.823; P$45 60.221,9.823; P$46 62.761,9.823; RST 52.601,27.603; VSYS 17.041,9.823 | hole 4.5: 5.15,33.7; 5.15,4.3; 77.7,33.7; 77.7,4.3
WE-REDCUBE-74650173 = drill 1.85 pad 3.2: P$1 -2.935,2.935; P$2 2.935,2.935; P$3 2.935,-2.935; P$4 -2.935,-2.935
RGB_LED_5MM = drill 0.6 long: ANODE_BLUE 2.54,0; ANODE_GREEN -1.27,0; ANODE_RED 0,0; CATHODE 1.27,0
UX60A-MB-5ST = smd 2 x 0.5: 1 2.25,1.6; 2 2.25,0.8; 3 2.25,0; 4 2.25,-0.8; 5 2.25,-1.6 | smd 2.2 x 2.5: M1 -3.3,-4.2; M2 -3.3,4.2; M3 2,4.2; M4 2,-4.2
W237-132 = drill 1.194 long: 1 -2.54,-0.635; 2 2.54,-0.635
W237-3E = drill 1.194 long: 1 -5.08,-0.635; 2 0,-0.635; 3 5.08,-0.635

### Placement (x,y rotation side)
C1  13.02,89.25 90 top
C2  5.08,70.2 180 top
C3  3.49,74.01 180 top
C4  18.73,84.48 90 top
C5  21.27,85.44 270 top
C6  15.88,83.22 270 top
C7  16.51,88.93 270 top
C8  110.81,65.75 270 top
C9  75.25,67.66 270 top
C10  89.53,72.74 90 top
C11  12.06,85.75 0 top
C12  12.06,83.53 0 top
C13  103.5,75.59 0 top
C14  107,76.87 0 top
C15  107,78.14 0 top
C16  99.69,68.61 0 top
C17  58.42,46.38 270 top
D1  100.97,78.45 0 top
D3  43.5,31.78 0 top
D5  102.55,15.27 0 top
D6  95.57,15.27 180 top
D10  73.66,15.27 180 top
D11  101.6,35.27 270 top
F1  20.64,20.35 90 top
FID1  9.53,92.52 0 top
FID2  115.71,34.61 0 top
FID3  5.65,6.53 0 top
H1  6.35,21.3 0 top
H2  4.76,89.25 0 top
H3  101.92,89.25 0 top
H4  85.72,22.89 0 top
IC1  45.09,79.72 0 top
IC2  105.41,68.93 180 top
IC3  69.22,67.66 90 top
IC4  92.08,72.74 90 top
IC5  5.08,80.67 0 top
IC6  115.25,68.29 90 top
IC7  65.41,46.38 90 top
J1  105.73,40.35 90 top
J2  89.22,39.72 90 top
J3  97.16,39.72 90 top
K2  43.18,22.89 270 top
LED2  52.07,61.62 90 top
PS1  30.48,78.77 180 top
Q1  98.11,72.42 90 top
Q2  107,57.18 0 top
Q3  107,60.99 180 top
Q8  29.53,24.16 180 top
Q10  100.97,29.56 270 top
Q11  75.25,23.52 180 top
Q12  61.59,23.52 180 top
Q13  100.97,20.98 270 top
R1  61.28,64.8 180 top
R2  103.82,56.86 270 top
R3  94.61,68.61 270 top
R4  94.61,66.07 270 top
R5  93.03,66.07 90 top
R6  91.44,66.07 270 top
R7  103.19,73.06 180 top
R8  103.19,74.33 180 top
R9  107.31,74.64 0 top
R10  107.63,63.85 180 top
R11  103.82,64.48 180 top
R12  110.81,71.47 90 top
R13  59.05,91.79 0 top
R14  92.39,79.72 0 top
R15  83.82,79.72 0 top
R16  80.64,79.72 0 top
R17  88.9,79.72 0 top
R18  52.07,63.21 0 top
R19  59.05,89.25 0 top
R20  102.55,52.73 180 top
R21  14.92,55.91 0 top
R22  14.92,53.37 0 top
R23  14.92,50.83 0 top
R24  14.92,48.29 0 top
R25  14.92,45.75 0 top
R26  61.28,61.94 180 top
R27  30.16,31.78 180 top
R28  98.11,35.59 0 top
R29  74.61,33.05 180 top
R30  67.63,26.38 270 top
R31  67.94,60.67 270 top
R32  70.48,60.67 270 top
R33  69.22,75.59 90 top
R34  71.75,75.59 90 top
R35  61.28,68.93 180 top
R36  61.28,71.47 180 top
R37  94.93,62.58 0 top
R38  94.93,60.04 0 top
R39  94.93,57.5 0 top
R40  67.31,52.73 180 top
R41  92.71,26.7 90 top
R42  105.09,35.59 180 top
R43  107.31,52.73 0 top
S1  82.23,86.07 90 top
S2  90.81,86.07 90 top
SV1  26.67,46.7 90 top
SV3  21.59,50.51 90 top
U$1  93.66,28.29 0 bottom
U$2  5.71,6.38 0 top
U$12  99.38,59.09 90 top
U$17  16.51,6.38 180 top
U$18  48.9,6.38 90 top
U$19  27.3,6.38 90 top
U$20  82.87,6.38 90 top
U$21  93.66,6.38 270 top
U$22  61.28,6.38 0 top
U$23  72.07,6.38 0 top
U$24  104.46,6.38 0 top
U$25  115.25,17.18 0 top
U$26  38.1,6.38 0 top
U$27  115.25,6.38 0 top
U$28  115.25,27.97 0 top
X1  115.57,87.98 180 top
X2  5.4,60.67 270 top
X3  5.4,50.51 270 top
X4  5.4,40.35 270 top
X5  117.47,41.62 270 top
X7  117.47,54.32 270 top

### Tracks (layer width: path | path; a pad name or v marks a point on that pad's centre or on a via)
+3V3  (via drill 0.35)
  Top 0.305: IC2.7 106.66,72.44 | C13.2 105.09,74.66 105.09,74.01 106.66,72.44 | R12.1 110.33,70.05 107.93,72.44 106.66,72.44
  Top 0.406: R25.2 R24.2 | R24.2 21.27,48.29 SV3.2 | R24.2 R23.2 R22.2 R21.2 17.14,55.91 20.32,59.09 20.32,61.94 21.27,62.9 28.57,62.9 32.7,67.02 32.7,68.93 32.38,69.25 31.75,69.88 30.16,69.88 27.62,67.34 17.46,67.34 16.83,67.97 16.83,70.2 8.48,78.55 IC5.4
  Top 0.508: R16.1 80.14,78.95 80.49,78.61 80.64,78.45 | R17.1 88.4,79.22 87.63,78.45 80.64,78.45 | 80.64,78.45 79.06,78.45 v78.42,79.09 | C13.2 104.16,77.17 v104.14,77.18
  Top 0.61: C6.1 18.5,83.86 C4.1
  Top 0.813: 32.7,83.85 32.84,83.71 IC1.2
  Top 1.016: IC5.2 IC5.4 9.84,80.67 10.79,81.63 12.06,81.63 | 12.06,81.63 12.91,82.48 C12.2 | 20.87,83.64 C5.2 32.52,84.04 | 20.87,83.64 C4.1 | 12.06,81.63 12.38,81.63 13.02,80.99 18.1,80.99 20.74,83.64 20.87,83.64 | 32.52,84.04 32.7,83.85 | J3.4 99.89,47.22 103.97,51.3 R20.1 R43.1 106.05,52.41 106.05,50.83 106.68,50.2 109.22,50.2 110.17,49.24 X7.3 119.7,52.1 119.7,66.39 117.79,68.29 IC6.1 110.81,68.29 | R12.1 110.81,68.29 | 110.81,68.29 C8.1 | R13.1 R19.1 57.63,86.87 v57.47,86.71 | v31.43,85.75 31.43,85.12 32.52,84.04
  Bottom 0.508: v57.47,86.71 58.42,87.66 69.85,87.66 v78.42,79.09 80.33,77.18 v104.14,77.18
  Bottom 1.016: J2.4 J3.4 | v57.47,86.71 57.47,85.75 55.24,83.53 53.66,83.53 33.66,83.53 v31.43,85.75
+3V3_CP2104  (via drill 0.35)
  Top 0.305: IC2.6 108.88,70.18 | 108.88,70.18 v108.9,70.2 | v108.9,73.37 107.81,74.46 R9.2 107.81,76.7 C14.2 C15.2 | IC2.5 108.38,69.68 108.88,70.18
  Bottom 0.305: v108.9,70.2 v108.9,73.37
+5V  (via drill 0.35)
  Top 0.305: IC4.8 91.1,73.98 90.65,73.53 | 90.65,73.53 90.5,73.39 C10.2 88.6,73.39 v87.63,72.42 | Q1.3 97.64,73.06 91.12,73.06 90.65,73.53 | R5.1 93.03,65.12 v92.39,64.48 | IC3.6 71.75,66.07 72.49,66.81 C9.2 77.57,66.81 v77.79,67.02 | IC7.28 61.18,50.93 60.96,51.15 58.74,51.15 58.42,50.83 C17.1 50.16,38.98 50.16,34.64 48.9,33.37 v48.58,33.37
  Top 1.016: IC5.3 3.51,76.55 6.67,76.55 v8.26,74.96 12.7,70.52 PS1.9 | C7.+ 15.38,85.75 C11.2 13.02,85.86 13.02,87.34 | 13.02,87.34 C1.1 | 13.02,87.34 11.11,87.34 v10.48,87.98 | D3.1 39.43,28.87 K2.A1
  Bottom 0.305: v92.39,64.48 87.79,69.09 | 87.79,69.09 87.63,69.25 v87.63,72.42 | v77.79,67.02 85.72,67.02 87.79,69.09
  Bottom 0.813: v92.39,64.48 92.39,59.09 85.41,52.1 85.41,44.72
  Bottom 1.016: v10.48,87.98 10.48,77.18 v8.26,74.96 | 29.53,34.95 SV1.1 | 29.53,34.95 34.61,34.95 39.43,30.13 K2.A1 39.43,29.62 43.18,33.37 v48.58,33.37 49.21,32.73 73.03,32.73 76.62,36.33 U$1.VSYS 76.52,38.21 76.52,42.26 78.98,44.72 85.41,44.72 J2.3 J3.3 | PS1.9 12.7,70.52 13.97,71.78 13.97,75.59 15.24,76.87 31.43,76.87 32.7,75.59 32.7,61.94 29.21,58.45 29.21,35.27 29.53,34.95
ADC_BUCHSE_1  (via drill 0.35)
  Top 0.305: v73.34,79.09 71.75,77.5 R34.2
  Bottom 0.305: X5.1 100.79,60.21 100.79,61.98 89.67,73.1 80.07,73.1 79.97,73.01 79.41,73.01 79.01,73.41 79.01,73.98 73.9,79.09 v73.34,79.09
ADC_BUCHSE_2  (via drill 0.35)
  Top 0.305: v81.28,74.64 80.09,75.84 77.56,75.84 73.62,79.77 73.06,79.77 71.74,78.45 62.55,78.45 v61.91,77.82 60.34,77.82 59.34,78.82 58.77,78.82 58.37,78.42 58.37,77.85 59.75,76.47 59.85,76.37 59.85,72.74 R36.2
  Bottom 0.305: v81.28,74.64 81.84,74.08 91.03,74.08 100.38,64.74 100.38,63.11 118.13,45.36 118.23,45.36 118.94,44.66 118.94,43.66 116.84,41.57 X5.2
ADC_CH1
  Top 0.305: IC3.1 65.25,64.8 R1.1 R26.1
ADC_CH2
  Top 0.305: IC3.3 R31.1 R32.1
ADC_CH3
  Top 0.305: IC3.11 R33.1 R34.1
ADC_CH4
  Top 0.305: IC3.13 66.67,68.93 66.36,68.61 63.02,68.61 R35.1 R36.1
ALCC  (via drill 0.35)
  Top 0.305: v87.31,57.18 88.85,55.64 90.14,55.64 92.39,53.38 v92.39,51.47 | IC1.4 34.47,81.17 v33.34,80.04 | v41.91,62.58 43.81,64.48 v49.53,64.48
  Top 0.406: J1.3 103.27,45.35 v102.55,46.07 | v98.74,52.73 R20.2
  Bottom 0.305: v49.53,64.48 52.19,61.82 58.53,61.82 63.22,57.13 65.69,57.13 65.74,57.18 v87.31,57.18 | v92.39,51.47 97.47,51.47 v98.74,52.73 | v33.34,80.04 33.97,79.41 33.97,63.53 34.92,62.58 v41.91,62.58
  Bottom 0.406: v102.55,46.07 98.74,49.88 v98.74,52.73
BAT+
  Top 2.54: U$17.P$3 U$17.P$4 U$17.P$1 U$17.P$2 U$17.P$3
  Bottom 1.27: U$17.P$4 19.45,19.16 F1.1
DHT22_DATA  (via drill 0.35)
  Top 0.305: IC6.2 114.66,70.79 112.56,72.89 R12.2 | IC1.31 54.1,75.58 55.18,75.58 57.78,72.98 57.78,68.29 58.74,67.34 67.63,67.34 v68.26,67.97 | v89.53,58.77 94.66,53.64 v96.84,53.64 | v103.82,55.01 110.86,55.01 113.35,57.5 v113.35,63.21
  Bottom 0.305: v68.26,67.97 72.4,67.97 76.34,64.04 82.78,64.04 87.44,59.38 88.92,59.38 v89.53,58.77 | v96.84,53.64 98.2,55.01 v103.82,55.01 | v113.35,63.21 117.47,67.34 117.47,69.56 116.25,70.79 IC6.2
DISPLAY_BUSY
  Top 0.305: IC1.26 53.77,69.56 54.93,69.56 55.56,68.93 55.56,62.58 53.66,60.67 39.05,60.67 38.42,60.04 38.42,55.99 | 38.42,55.99 U$1.BUSY | SV1.8 27.94,55.59 29.53,54.01 37.15,54.01 38.42,55.27 38.42,55.99
DISPLAY_CLK  (via drill 0.35)
  Top 0.305: IC1.30 55.38,74.82 57.15,73.06 v57.15,60.67 | SV1.4 42.86,45.43 v44.13,46.7
  Bottom 0.305: v57.15,60.67 56.85,60.67 56.09,61.43 48.7,61.43 46.14,58.87 U$1.CLK 46.14,48.71 v44.13,46.7
DISPLAY_CS  (via drill 0.35)
  Top 0.305: IC1.29 55.38,73.55 56.74,72.19 56.74,61.68 v55.81,60.74 | SV1.5 49.21,47.97 v51.12,49.88
  Bottom 0.305: v55.81,60.74 53.41,60.74 51.22,58.55 U$1.CS 51.12,55.79 v51.12,49.88
DISPLAY_DC
  Top 0.305: IC1.28 55.38,72.28 56.35,71.31 56.35,62.25 53.76,59.66 U$1.DC 53.76,54.43 49.85,50.51 SV1.6
DISPLAY_DIN  (via drill 0.35)
  Top 0.305: IC1.37 50.98,83.71 48.9,81.63 v48.9,73.69 | SV1.3 39.69,42.89 40.96,44.16 v41.59,44.16
  Bottom 0.305: v48.9,73.69 43.6,68.4 U$1.DIN 43.81,55.68 43.81,53.37 41.59,51.15 v41.59,44.16
DISPLAY_RST
  Top 0.305: IC1.27 53.77,70.83 55.24,70.83 55.96,70.12 55.96,62.41 53.82,60.28 41.52,60.28 40.96,59.72 40.96,55.99 U$1.RST 41.06,54.74 39.37,53.05 SV1.7
DS18B20_DATA  (via drill 0.35)
  Top 0.305: v66.36,73.69 66.6,73.69 68.19,75.28 72.78,75.28 72.96,75.1 72.96,75.02 83.39,64.59 89.59,64.59 91.11,63.06 91.11,57.76 94.55,54.32 107.95,54.32 108.27,54.01 R43.2
  Top 0.406: X7.2 115.25,52.73 R43.2 | IC1.11 38.28,72.28 v39.69,73.69 | v45.4,73.69 47.86,73.69 48.59,72.96 49.75,72.96 v51.12,74.33
  Bottom 0.406: v39.69,73.69 v45.4,73.69 | v51.12,74.33 55.56,74.33 56.66,73.23 65.9,73.23 v66.36,73.69
DTR
  Top 0.305: Q3.2 108.1,63.81 R10.1 108.13,64.62 107.63,65.12 107,65.12 106.16,65.95 IC2.23
EN  (via drill 0.35)
  Top 0.305: Q2.3 109.05,58.13 v109.54,58.13 | v86.36,76.23 79.69,76.23 76.2,79.72 | R16.2 81.14,80.81 80.96,80.99 77.47,80.99 76.2,79.72 | 76.2,79.72 70.17,85.75 67.63,85.75 v67.31,85.44 | IC1.3 39.51,82.44 v40.32,81.63
  Top 0.508: R16.2 R15.1
  Bottom 0.305: v109.54,58.13 105.78,61.9 103.86,61.9 100.33,65.42 100.33,68.29 92.39,76.23 v86.36,76.23 | v40.32,81.63 41.48,82.78 55.87,82.78 57.93,84.84 58.15,84.84 58.74,85.42 v67.31,85.44
EXTERN_BUCHSE
  Top 0.305: R32.2 81.11,59.25 82.55,57.81 82.55,36.86 80.64,34.95 59.69,34.95 55.88,31.14 55.88,20.35 51.44,15.9 33.02,15.9 30.24,13.12 U$19.P$3
  Top 2.54: U$19.P$2 U$19.P$3 U$19.P$4 U$19.P$1 U$19.P$2
FAN_+
  Top 1.016: D5.1 101.39,9.45 U$24.P$1
  Top 2.54: U$24.P$1 U$24.P$2 U$24.P$3 U$24.P$4 U$24.P$1
  Bottom 1.016: K2.11 38.18,20.11 40.32,22.26 50.16,22.26 54.61,17.81 99.06,17.81 101.52,15.35 U$24.P$1
FAN_-
  Top 1.016: U$27.P$1 106.36,15.27 D5.2 103.72,19.61 103.82,19.71 103.82,20.44 Q13.2
  Top 2.54: U$27.P$1 U$27.P$2 U$27.P$3 U$27.P$4 U$27.P$1
FAN_PWM  (via drill 0.35)
  Top 0.305: IC7.12 68.33,41.87 69.48,40.72 69.81,40.72 70.5,40.03 v79.69,40.03 | v83.82,29.88 85.41,28.29 87.63,28.29 90.64,25.28 R41.1
  Top 1.016: Q13.1 93.28,23.27 92.71,23.84 R41.1
  Bottom 0.305: v79.69,40.03 83.82,35.91 v83.82,29.88
FREE
  cutout Bottom: 34.28,85.85 55.19,85.85 55.19,94.08 34.29,94.08
FREE_2
  cutout Top: 55.19,85.82 55.19,93.86 34.3,93.86 34.3,85.81
GATE_CMD
  Top 0.305: IC4.1 91.1,71.44 91.44,71.78 96.69,71.78 Q1.1
GND  (via drill 0.35)
  Top 0.305: C13.1 102.86,74.49 R8.2 | 111.44,92.74 118.43,92.74 | 118.43,83.53 111.12,83.53
  other vias: 88.9,69.88 77.47,83.53 95.25,70.83 88.58,75.28 104.78,79.09 77.79,61.62
  pour Bottom (rank 2): 122.1,93.98 122.1,14 -0.04,14 -0.04,93.98
  pour Top (rank 2): 122.01,94.01 122.01,14 0.1,14 0.1,94.01
  pour Top: 0,0.03 0,14 10.16,14 10.79,14 10.79,0.03
  pour Bottom: 0,0.03 0,14 10.79,14 10.79,0.03
IO0  (via drill 0.35)
  Top 0.305: Q3.3 105.9,63.04 v105.41,63.53 | v95.89,75.91 94.93,75.91 91.89,78.95 R14.1 | R17.2 89,80.12 89,80.2 83.77,85.44 71.04,85.44 70.33,86.15 68.55,86.15 v68.26,86.44 | v64.14,79.72 63.5,79.09 v61.28,79.09 | v50.16,70.52 52.21,68.47 IC1.25
  Top 0.508: R17.2 R14.1
  Bottom 0.305: v105.41,63.53 102.6,66.34 102.6,66.67 95.89,73.39 v95.89,75.91 | v68.26,86.44 68.26,83.85 v64.14,79.72 | v61.28,79.09 59.69,79.09 56.39,82.39 49.97,82.39 49.85,82.26 49.85,70.83 v50.16,70.52
IO2
  Top 0.305: R18.1 50.8,63.98 IC1.24
LADEN_BUCHSE  (via drill 0.35)
  Top 0.305: K2.14 48.18,20.27 v52.07,24.16 | v54.61,30.83 59.37,35.59 80.01,35.59 81.6,37.18 81.6,57.5 80.95,58.15 66.92,58.15 65.98,59.09 60.33,59.09 59.69,59.72 59.69,61.78 R26.2
  Top 1.27: D6.1 95.57,9.32 U$21.P$1
  Top 2.54: U$18.P$1 U$18.P$4 U$18.P$3 U$18.P$2 U$18.P$1 | U$21.P$4 U$21.P$1 U$21.P$2 U$21.P$3 U$21.P$4
  Bottom 0.305: v52.07,24.16 54.61,26.7 v54.61,30.83
  Bottom 1.27: U$18.P$2 45.96,12.02 48.26,14.32 | 48.26,14.32 48.26,19 K2.14 | 48.26,14.32 49.53,13.05 88.58,13.05 90.73,10.9 U$21.P$4
MOSFET_PC_REMOTE  (via drill 0.35)
  Top 0.305: IC7.13 68.98,41.86 69.53,41.3 79.69,41.3 v80.01,41.62 | v93.66,35.91 96.37,35.91 96.84,35.43
  Top 1.016: Q10.1 96.84,35.43 R28.1
  Bottom 0.305: v80.01,41.62 85.72,35.91 v93.66,35.91
N$3
  Top 0.305: R2.1 106.55,57.36 108.1,58.91 Q3.1
N$4
  Top 0.305: IC4.7 91.75,76.54 92.08,76.87 92.4,76.54 IC4.6
N$5
  Top 0.305: IC2.8 106.16,72.31 105.41,73.06 R7.1 R8.1
N$6  (via drill 0.35)
  Top 0.305: IC2.9 105.66,71.85 105.41,72.1 v104.46,72.1 | v106.05,75.28 106.68,74.64 R9.1
  Bottom 0.305: v104.46,72.1 106.05,73.69 v106.05,75.28
N$7
  Top 0.305: IC2.16 101.98,68.68 101.92,68.61 C16.2
N$8
  Top 0.305: IC2.21 105.16,65.19 104.46,64.48 R11.1
N$9
  Top 0.305: Q2.1 105.9,58.3 107.13,59.54 R10.2
N$10
  Top 0.508: R15.2 84.32,82.86 S1.D1
N$11
  Top 0.508: R14.2 92.89,82.86 S2.D1
N$12
  Top 0.305: R18.2 52.82,62.96 LED2.A
N$13
  Top 1.016: D3.2 46.93,29.51 K2.A2 43.72,25.33 40.96,22.57 30.25,22.57 Q8.2
N$16
  Top 0.305: U$12.ANODE_GREEN 99.06,57.5 R39.2
N$20
  Top 0.305: U$12.ANODE_BLUE 97.79,61.62 96.84,62.58 R37.2
N$22
  Top 0.305: U$12.ANODE_RED 97.47,59.09 96.52,60.04 R38.2
N$23
  Top 0.305: R40.2 64.45,51.3 64.45,49.35 IC7.23
OPAMP-NEG
  Top 0.305: R5.2 91.76,66.57 | 91.76,66.57 R6.1 | IC4.2 91.76,66.57
OPAMP-POS
  Top 0.305: R4.1 R3.2 93.21,68.11 92.4,68.92 IC4.3
PC_REMOTE_ANSCHLUSS
  Top 1.016: U$25.P$1 108.9,23.52 108.9,26.38 106.36,28.92 103.19,28.92 103.19,29.46 Q10.2
  Top 2.54: U$25.P$4 U$25.P$3 U$25.P$2 U$25.P$1 U$25.P$4
PC_REMOTE_LED
  Top 0.813: R42.1 107.63,35.59 U$28.P$1
  Top 2.54: U$28.P$1 U$28.P$2 U$28.P$3 U$28.P$4 U$28.P$1
PC_REMOTE_LED_3V3  (via drill 0.35)
  Top 0.305: 95.57,37.18 100.97,37.18 101.6,36.54 D11.1 103.21,36.05 R42.2
  Top 0.406: IC1.12 38.28,71.01 39.69,72.42 v40.01,72.42 | v45.4,72.42 50.8,72.42 v51.12,72.74 | v85.09,63.53 85.86,62.76 85.86,60.89 93.66,53.09 93.66,39.08 95.57,37.18
  Bottom 0.406: v40.01,72.42 v45.4,72.42 | v51.12,72.74 68.27,72.74 76.52,64.48 84.77,64.48 85.09,64.16 v85.09,63.53
RELAIS_FAN
  Top 0.305: IC7.9 66.26,43.33 66.26,42.58 64.03,40.35 56.52,40.35 54.93,38.77 54.93,35.27 50.8,31.14 47.94,31.14 45.4,33.69 33.49,33.69 R27.1
  Top 0.813: R27.1 31.81,31.55 Q8.1
RELAIS_R1_R2  (via drill 0.35)
  Top 0.305: IC7.11 67.68,41.57 69.22,40.03 v69.53,40.03 | v70.48,34 71.04,34.56 75.32,34.56 76.2,33.69 76.2,33.22 R29.1
  Top 0.813: Q11.1 77.53,31.55 R29.1
  Bottom 0.305: v69.53,40.03 69.53,39.01 70.01,38.53 70.01,34.48 v70.48,34
RELAIS_R1_R2_ANSCHLUSS
  Top 1.016: D6.2 76.07,20.67 75.79,20.67 Q11.2
  Top 1.27: D6.2 81.47,9.32 U$20.P$2
  Top 2.54: U$20.P$2 U$20.P$3 U$20.P$4 U$20.P$1 U$20.P$2
RELAIS_R3  (via drill 0.35)
  Top 0.305: IC7.10 67.03,40.63 v67.63,40.03 | v67.63,34 R30.1
  Top 0.813: Q12.1 64.04,27.8 R30.1
  Bottom 0.305: v67.63,40.03 v67.63,34
RELAIS_R3_ANSCHLUSS
  Top 1.016: D10.2 61.59,17.3 Q12.2
  Top 1.27: D10.2 59.56,9.32 U$22.P$1
  Top 2.54: U$22.P$1 U$22.P$2 U$22.P$3 U$22.P$4 U$22.P$1
RGB_BLAU1  (via drill 0.35)
  Top 0.305: R37.1 95.1,64.16 v95.89,64.16 | v88.9,53.32 v84.77,53.32 | v64.44,47.03 IC7.6
  Bottom 0.305: v95.89,64.16 95.89,56.56 96.57,55.88 96.57,55.31 94.87,53.61 90.42,53.61 90.14,53.32 v88.9,53.32 | v84.77,53.32 81.87,53.32 75.09,46.55 67.41,46.55 67.12,46.26 65.2,46.26 v64.44,47.02 v64.44,47.03
RGB_GREEN1  (via drill 0.35)
  Top 0.305: R39.1 94.3,56.71 v94.3,55.91 | v89.85,54.96 v86.36,54.96 | v66.67,47.34 65.72,46.38 IC7.8
  Bottom 0.305: v94.3,55.91 93.34,54.96 v89.85,54.96 | v86.36,54.96 82.23,54.96 74.61,47.34 v66.67,47.34
RGB_ROT1  (via drill 0.35)
  Top 0.305: R38.1 94.93,58.62 94.93,56.55 v95.89,55.59 | v89.85,54.01 v85.72,54.01 | IC7.7 65.08,46.71 v65.4,47.03
  Bottom 0.305: v95.89,55.59 94.3,54.01 v89.85,54.01 | v85.72,54.01 81.92,54.01 74.85,46.94 67.25,46.94 66.96,46.65 65.77,46.65 v65.4,47.03
ROT_CLK
  Top 0.305: SV3.5 21.59,58.77 25.27,62.45 28.76,62.45 30.47,64.16 30.48,64.16 34.79,68.47 IC1.14
ROT_DT
  Top 0.305: SV3.4 23.5,54.96 23.5,60.12 25.44,62.06 28.92,62.06 30.64,63.77 34.21,67.34 37.47,67.34 38.1,67.97 38.1,68.93 38.73,69.56 40.32,69.56 40.64,69.25 IC1.16
ROT_SW  (via drill 0.35)
  Top 0.305: SV3.3 23.89,52.81 23.89,59.95 25.6,61.66 29.09,61.66 31.91,64.48 34.92,64.48 v35.24,64.8 | v40.01,71.15 38.81,69.96 38.57,69.96 38.36,69.74 IC1.13
  Bottom 0.305: v35.24,64.8 35.24,66.39 v40.01,71.15
RTS  (via drill 0.35)
  Top 0.305: Q2.2 103.95,56.23 R2.2 103.37,56.36 102.87,56.86 102.87,61.31 v104.14,62.58 | IC2.19 104.16,66.09 103.82,65.75 102.55,65.75 v101.92,66.39
  Bottom 0.305: v101.92,66.39 101.92,64.8 v104.14,62.58
SCL  (via drill 0.35)
  Top 0.305: R13.2 59.05,90.36 59.05,86.71 54.93,82.58 53.72,82.58 IC1.36 53.07,81.93 52.46,81.93 50.8,80.27 v50.8,77.5 | v63.82,75.91 68.19,75.91 73.33,75.91 75.94,73.3 76.55,73.3 v77.11,72.74 | v73.66,72.42 73.66,70.99 IC3.8 74.02,69.36 76.41,69.36 79.06,66.72 v79.06,62.9 79.06,60.67 79.69,60.04 81.44,60.04 83.9,57.58 83.9,44.8 85.48,43.21 88.61,43.21 88.75,43.35 89.69,43.35 90.35,42.69 90.35,41.75 89.22,40.62 J2.1 | IC7.26 62.48,52.35 65.41,55.27 v65.41,57.81
  Bottom 0.305: v50.8,77.5 55.88,77.5 57.47,75.91 v63.82,75.91 | v77.11,72.74 76.79,72.42 v73.66,72.42 | v79.06,62.9 75.9,62.9 75.29,62.29 69.88,62.29 v65.41,57.81
  Bottom 1.016: J2.1 J3.1 105.09,39.72 J1.1
SDA  (via drill 0.35)
  Top 0.305: IC1.33 56.02,78.63 56.36,78.29 | 56.36,78.29 57.78,76.87 v58.1,76.87 | v64.77,74.64 65.67,73.74 65.67,73.41 67.67,71.41 68.4,71.41 68.58,71.22 68.58,69.48 71.12,66.94 71.12,64.08 71.3,63.9 71.38,63.9 71.75,63.53 72.39,63.53 73.03,64.16 IC3.7 v75.01,62.97 78.34,59.64 81.28,59.64 83.5,57.42 83.5,43.53 84.81,42.22 J2.2 | v63.5,57.81 63.5,56.9 62.91,56.31 62.91,53.37 61.83,52.29 IC7.27 | R19.2 60.48,82.42 56.36,78.29
  Bottom 0.305: v64.77,74.64 64.5,74.91 64.5,76.19 63.83,76.87 v58.1,76.87 | v63.5,57.81 68.66,62.97 v75.01,62.97
  Bottom 1.016: J2.2 J3.2 105.09,42.22 J1.2
SYSTEM
  Top 2.54: U$26.P$1 U$26.P$4 U$26.P$3 U$26.P$2 U$26.P$1
  Bottom 1.27: U$26.P$2 41.03,14.08 43.18,16.22 K2.12
TASTER_1  (via drill 0.35)
  Top 0.305: v26.04,73.06 26.62,73.64 26.62,74.29 27.02,74.69 27.43,74.69 29.68,76.94 33.41,76.94 35.1,78.63 IC1.6
  Top 0.406: X2.1 5.4,63.21 12.7,55.91 R21.1
  Bottom 0.305: X2.1 9.45,58.53 17.93,58.53 20.97,61.56 20.97,63.87 26.59,69.49 26.59,72.24 26.55,72.29 26.55,72.54 v26.04,73.06
TASTER_2  (via drill 0.35)
  Top 0.305: v27.3,74.01 29.84,76.55 34.29,76.55 35.1,77.36 IC1.7
  Top 0.406: X2.2 7.94,58.13 12.7,53.37 R22.1
  Bottom 0.305: X2.2 18.1,58.13 21.36,61.4 21.36,63.7 26.99,69.33 26.99,72.41 26.94,72.45 26.94,73.64 v27.3,74.01
TASTER_3  (via drill 0.35)
  Top 0.305: v27.62,72.74 30.98,76.09 IC1.8
  Top 0.406: X3.1 9.21,53.05 11.43,50.83 R23.1
  Bottom 0.305: X3.1 13.65,53.05 21.75,61.16 21.75,63.54 27.55,69.33 27.55,71.63 27.62,71.71 v27.62,72.74
TASTER_4  (via drill 0.35)
  Top 0.305: v28.89,72.42 31.3,74.82 IC1.9
  Top 0.406: X3.2 5.08,48.29 R24.1
  Bottom 0.305: X3.2 5.71,48.92 10.24,48.92 22.15,60.84 22.15,63.38 27.94,69.17 27.94,71.47 v28.89,72.42
TASTER_5  (via drill 0.35)
  Top 0.305: v29.84,71.15 32.25,73.55 IC1.10
  Top 0.406: X4.1 7.62,45.75 R25.1
  Bottom 0.305: X4.1 19.68,57.81 20.95,57.81 22.54,59.4 22.54,62.26 22.54,63.21 29.84,70.52 v29.84,71.15
UART_ESP_RXD0  (via drill 0.35)
  Top 0.305: R11.2 99.72,64.48 v99.69,64.45 | v79.69,73.69 76.52,73.69 v75.88,74.33 | v66.67,76.87 60.33,76.87 v59.05,78.14 | v56.52,80.04 53.72,80.04 IC1.34
  Bottom 0.305: v99.69,64.45 90.46,73.69 v79.69,73.69 | v75.88,74.33 69.22,74.33 v66.67,76.87 | v59.05,78.14 58.42,78.14 v56.52,80.04
UART_ESP_TXD0  (via drill 0.35)
  Top 0.305: IC2.20 104.66,65.34 104.46,65.14 98.09,65.14 95.26,65.14 93.93,63.8 91.17,63.8 v88.9,66.07 | IC1.35 53.7,81.05 54.71,81.05 56.87,83.22 v58.42,83.22
  Bottom 0.305: v58.42,83.22 76.52,65.12 87.95,65.12 v88.9,66.07
USB_DN  (via drill 0.35)
  Top 0.305: X1.2 110.33,87.18 105.73,82.58 v105.73,81.94 | v100.33,81.94 100.02,81.63 D1.4 | IC2.4 108.97,69.18 v109.22,68.93
  Bottom 0.305: v100.33,81.94 v105.73,81.94 109.58,78.09 109.58,69.91 109.22,69.55 v109.22,68.93
USB_DP  (via drill 0.35)
  Top 0.305: X1.3 109.54,87.98 v106.36,84.8 104.78,83.22 103.5,83.22 101.92,81.62 D1.3 | IC2.3 108.5,68.68 108.9,68.28 v108.9,66.7
  Bottom 0.305: v108.9,66.7 108.9,67.64 110.02,68.76 110.02,81.15 v106.36,84.8
USBVCC
  Top 0.305: Q1.2 100.79,73.06 101.92,73.06 | 101.92,73.06 R7.2 | 101.92,73.06 D1.2 102.09,77.35 103.19,78.45 103.19,79.41 103.82,80.04 106.05,80.04 107.31,81.31 107.31,82.58 111.11,86.38 X1.1
VCC  (via drill 0.35)
  Top 0.305: C3.2 1.59,75.06 v1.59,75.91 | v91.44,77.97 91.51,77.89 92.24,77.89 95.39,74.74 98.22,74.74 98.71,74.25 98.71,72.79 97.76,71.84 97.76,70.59 97.58,70.41 95.92,70.41 R3.1
  Top 1.016: C3.2 2.64,70.59 C2.+
  Top 1.27: C2.+ 6.84,66.39 28.26,66.39 PS1.16 | D10.1 73.66,9.32 U$23.P$2
  Top 2.54: U$23.P$1 U$23.P$2 U$23.P$3 U$23.P$4 U$23.P$1
  Bottom 0.305: v1.59,75.91 8.89,83.22 8.89,87.41 8.98,87.5 8.98,88.38 13.34,92.74 26.35,92.74 33.97,85.12 55.24,85.12 56.2,86.07 56.2,87.03 57.78,88.61 69.85,88.61 78.69,79.77 78.7,79.77 80.66,77.82 91.44,77.82 v91.44,77.97
  Bottom 1.016: U$23.P$4 69.14,2.61 67.31,0.78 23.06,0.78 21.91,1.94 21.91,15.9 24.45,18.45 24.45,22.74 F1.2
  Bottom 1.27: F1.2 21.74,42.87 23.7,44.83 23.7,61.83 PS1.16

### Text on the board
tNames: RESET | BOOT | ACT | +3,3V 18B20 GND | CLK / DRT / SW / 3.3V / GND | BUSY / RST / DC / CS / CLK / DIN / GND / +5V | GND / 3.3V / 5V / SDA / SCL | 1 / 2 / 3 / 4 / 5 / / GND | ADC 1 2 | CAMO.NRW / DESIGN BY / TOBIAS POPPE 2021 | PC LED | PC Remote | GND | BAT+ | EXTERN | SYSTEM | CHARGER | R3 - | R3 + | R1,R2 - | R1,R2 + | FAN + | FAN -